# EasyEDA Pro project ProProject_MagicBerry_2.1.epro, schematic sch_2.1

## Sheets
1 mcu: Create Date: 2023-12-22; Page Name: mcu; Project Name: MagicBerry_2.1; Schematic Name: sch_2.1; Update Date: 2023-12-22; Company: 嘉立创EDA; Drawed: MakerM0; Page Size: A4; Version: V1.0
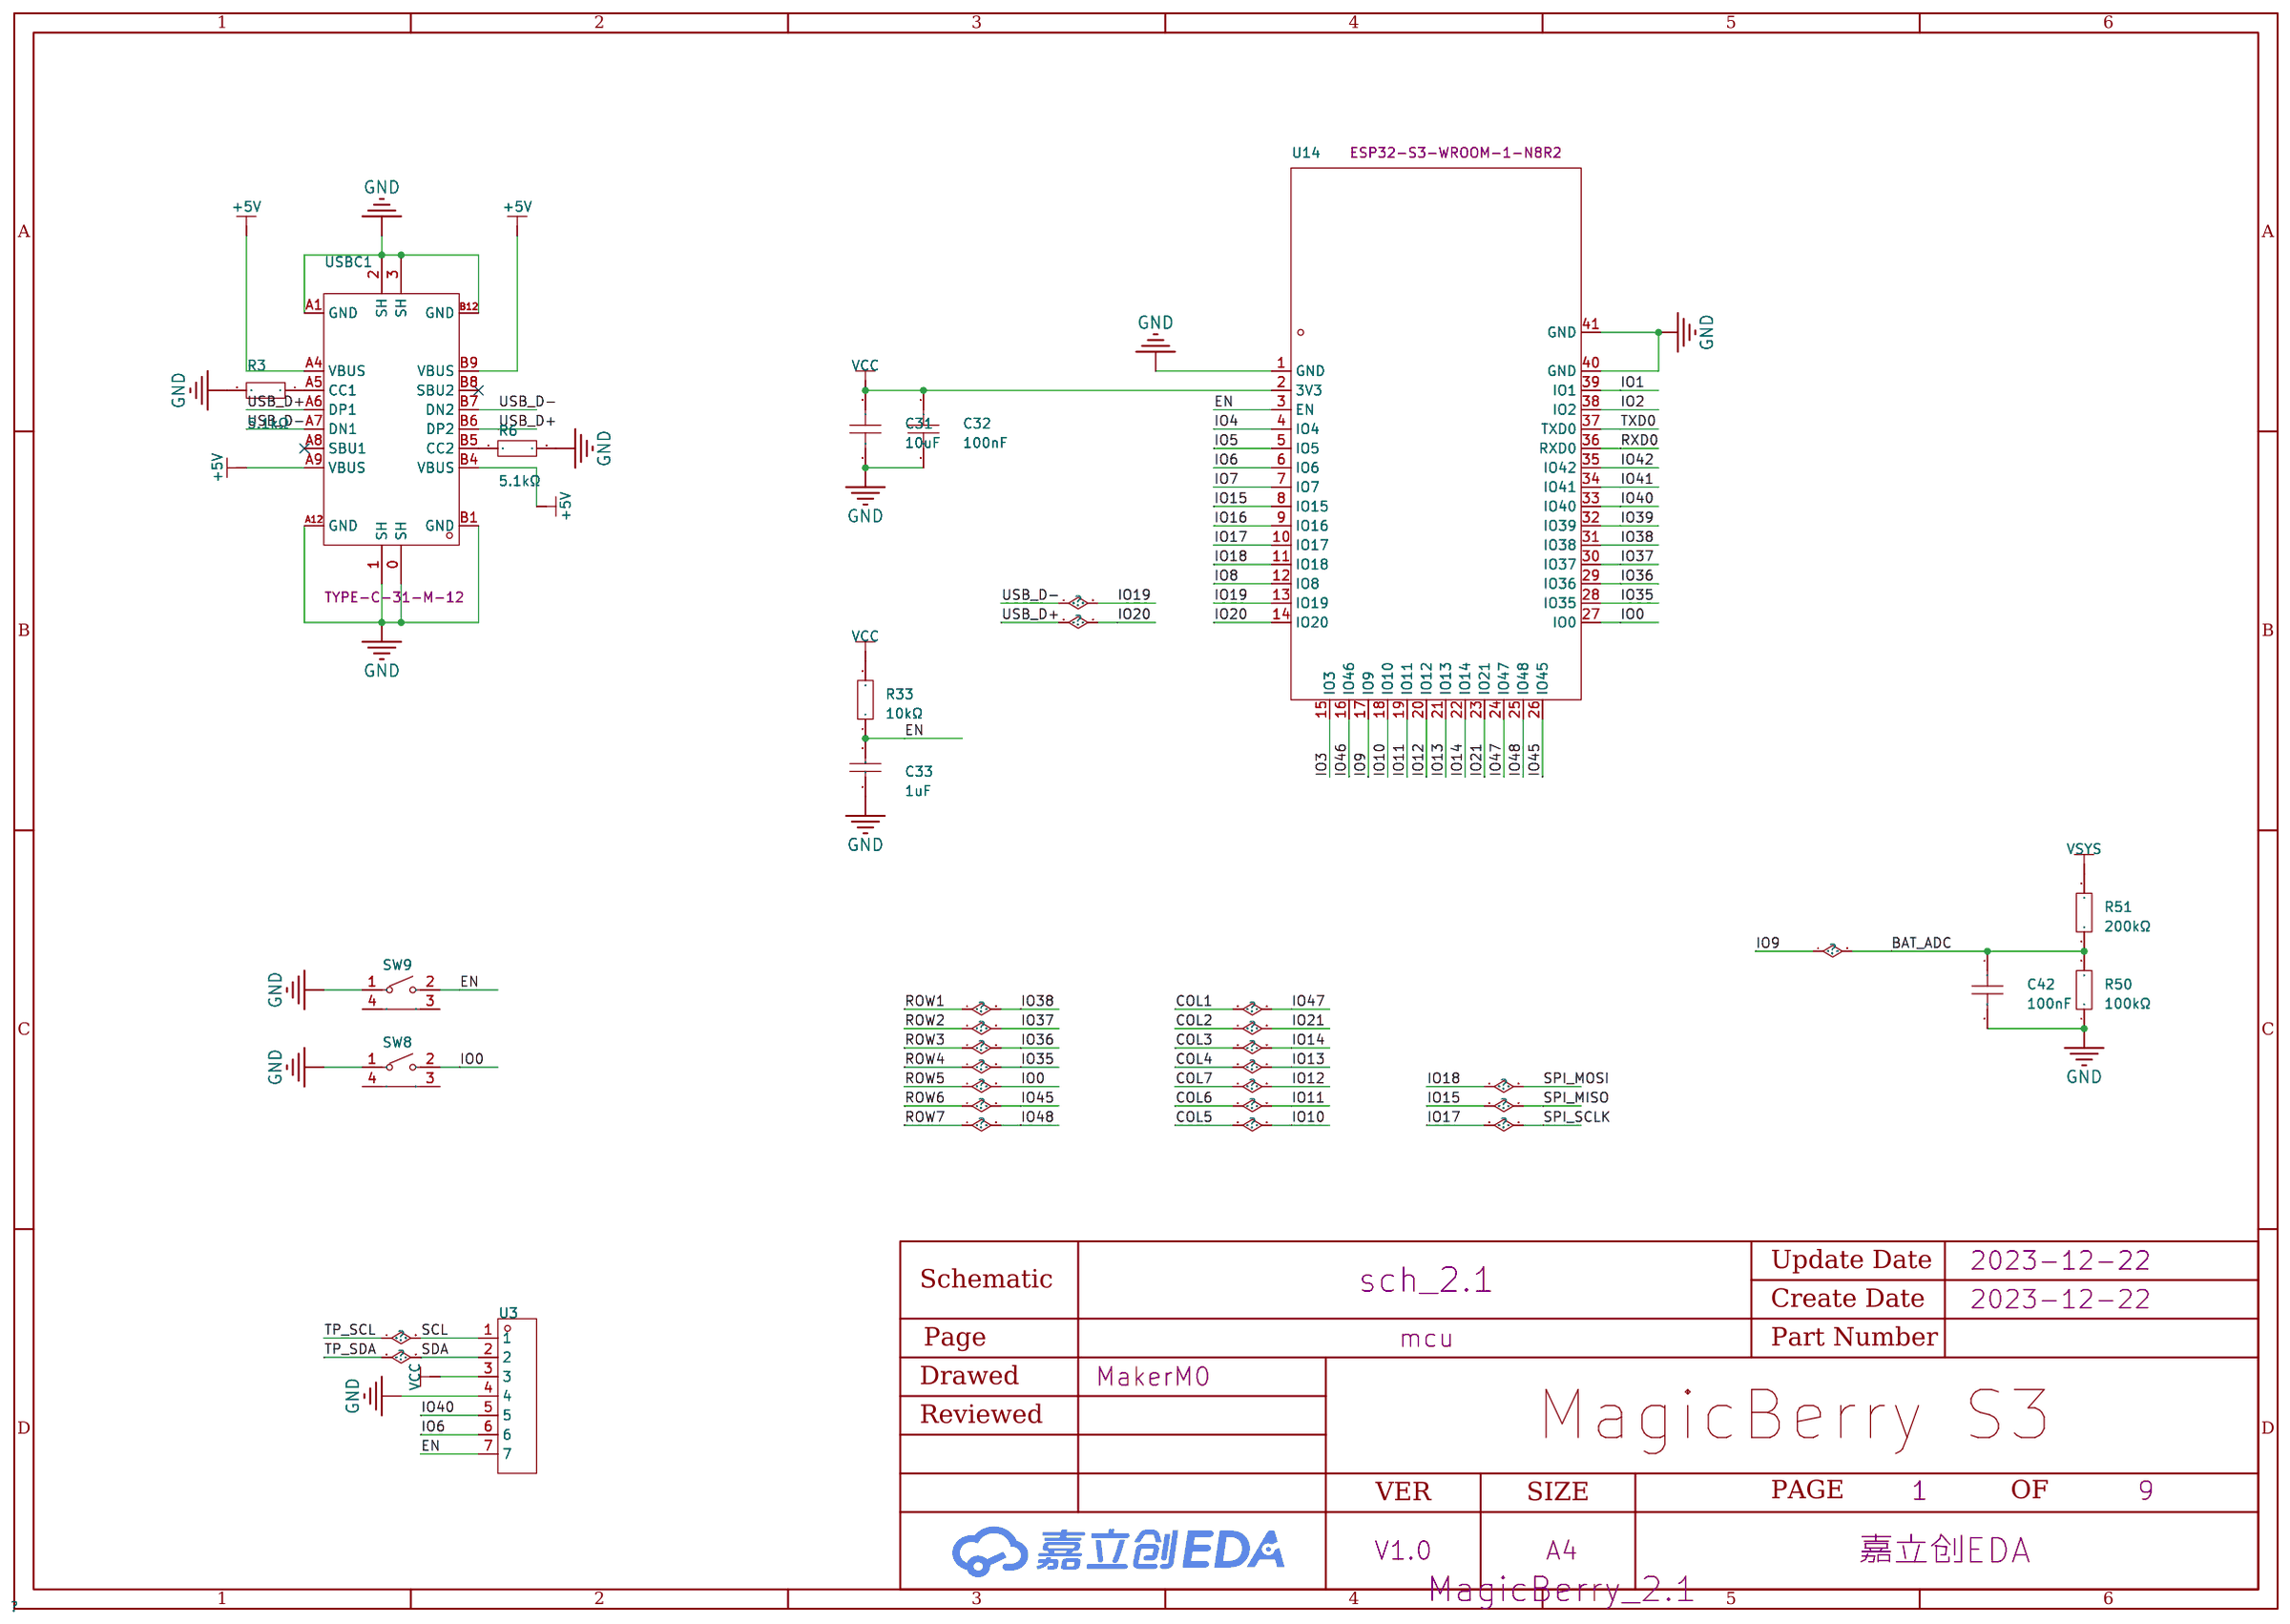
[diagram p0: mcu]
2 lcd: Create Date: 2023-09-30; Page Name: lcd; Project Name: #第八届立创电赛#MagicBerry  一个支持扩展的可编程全键盘终端; Update Date: 2023-09-30
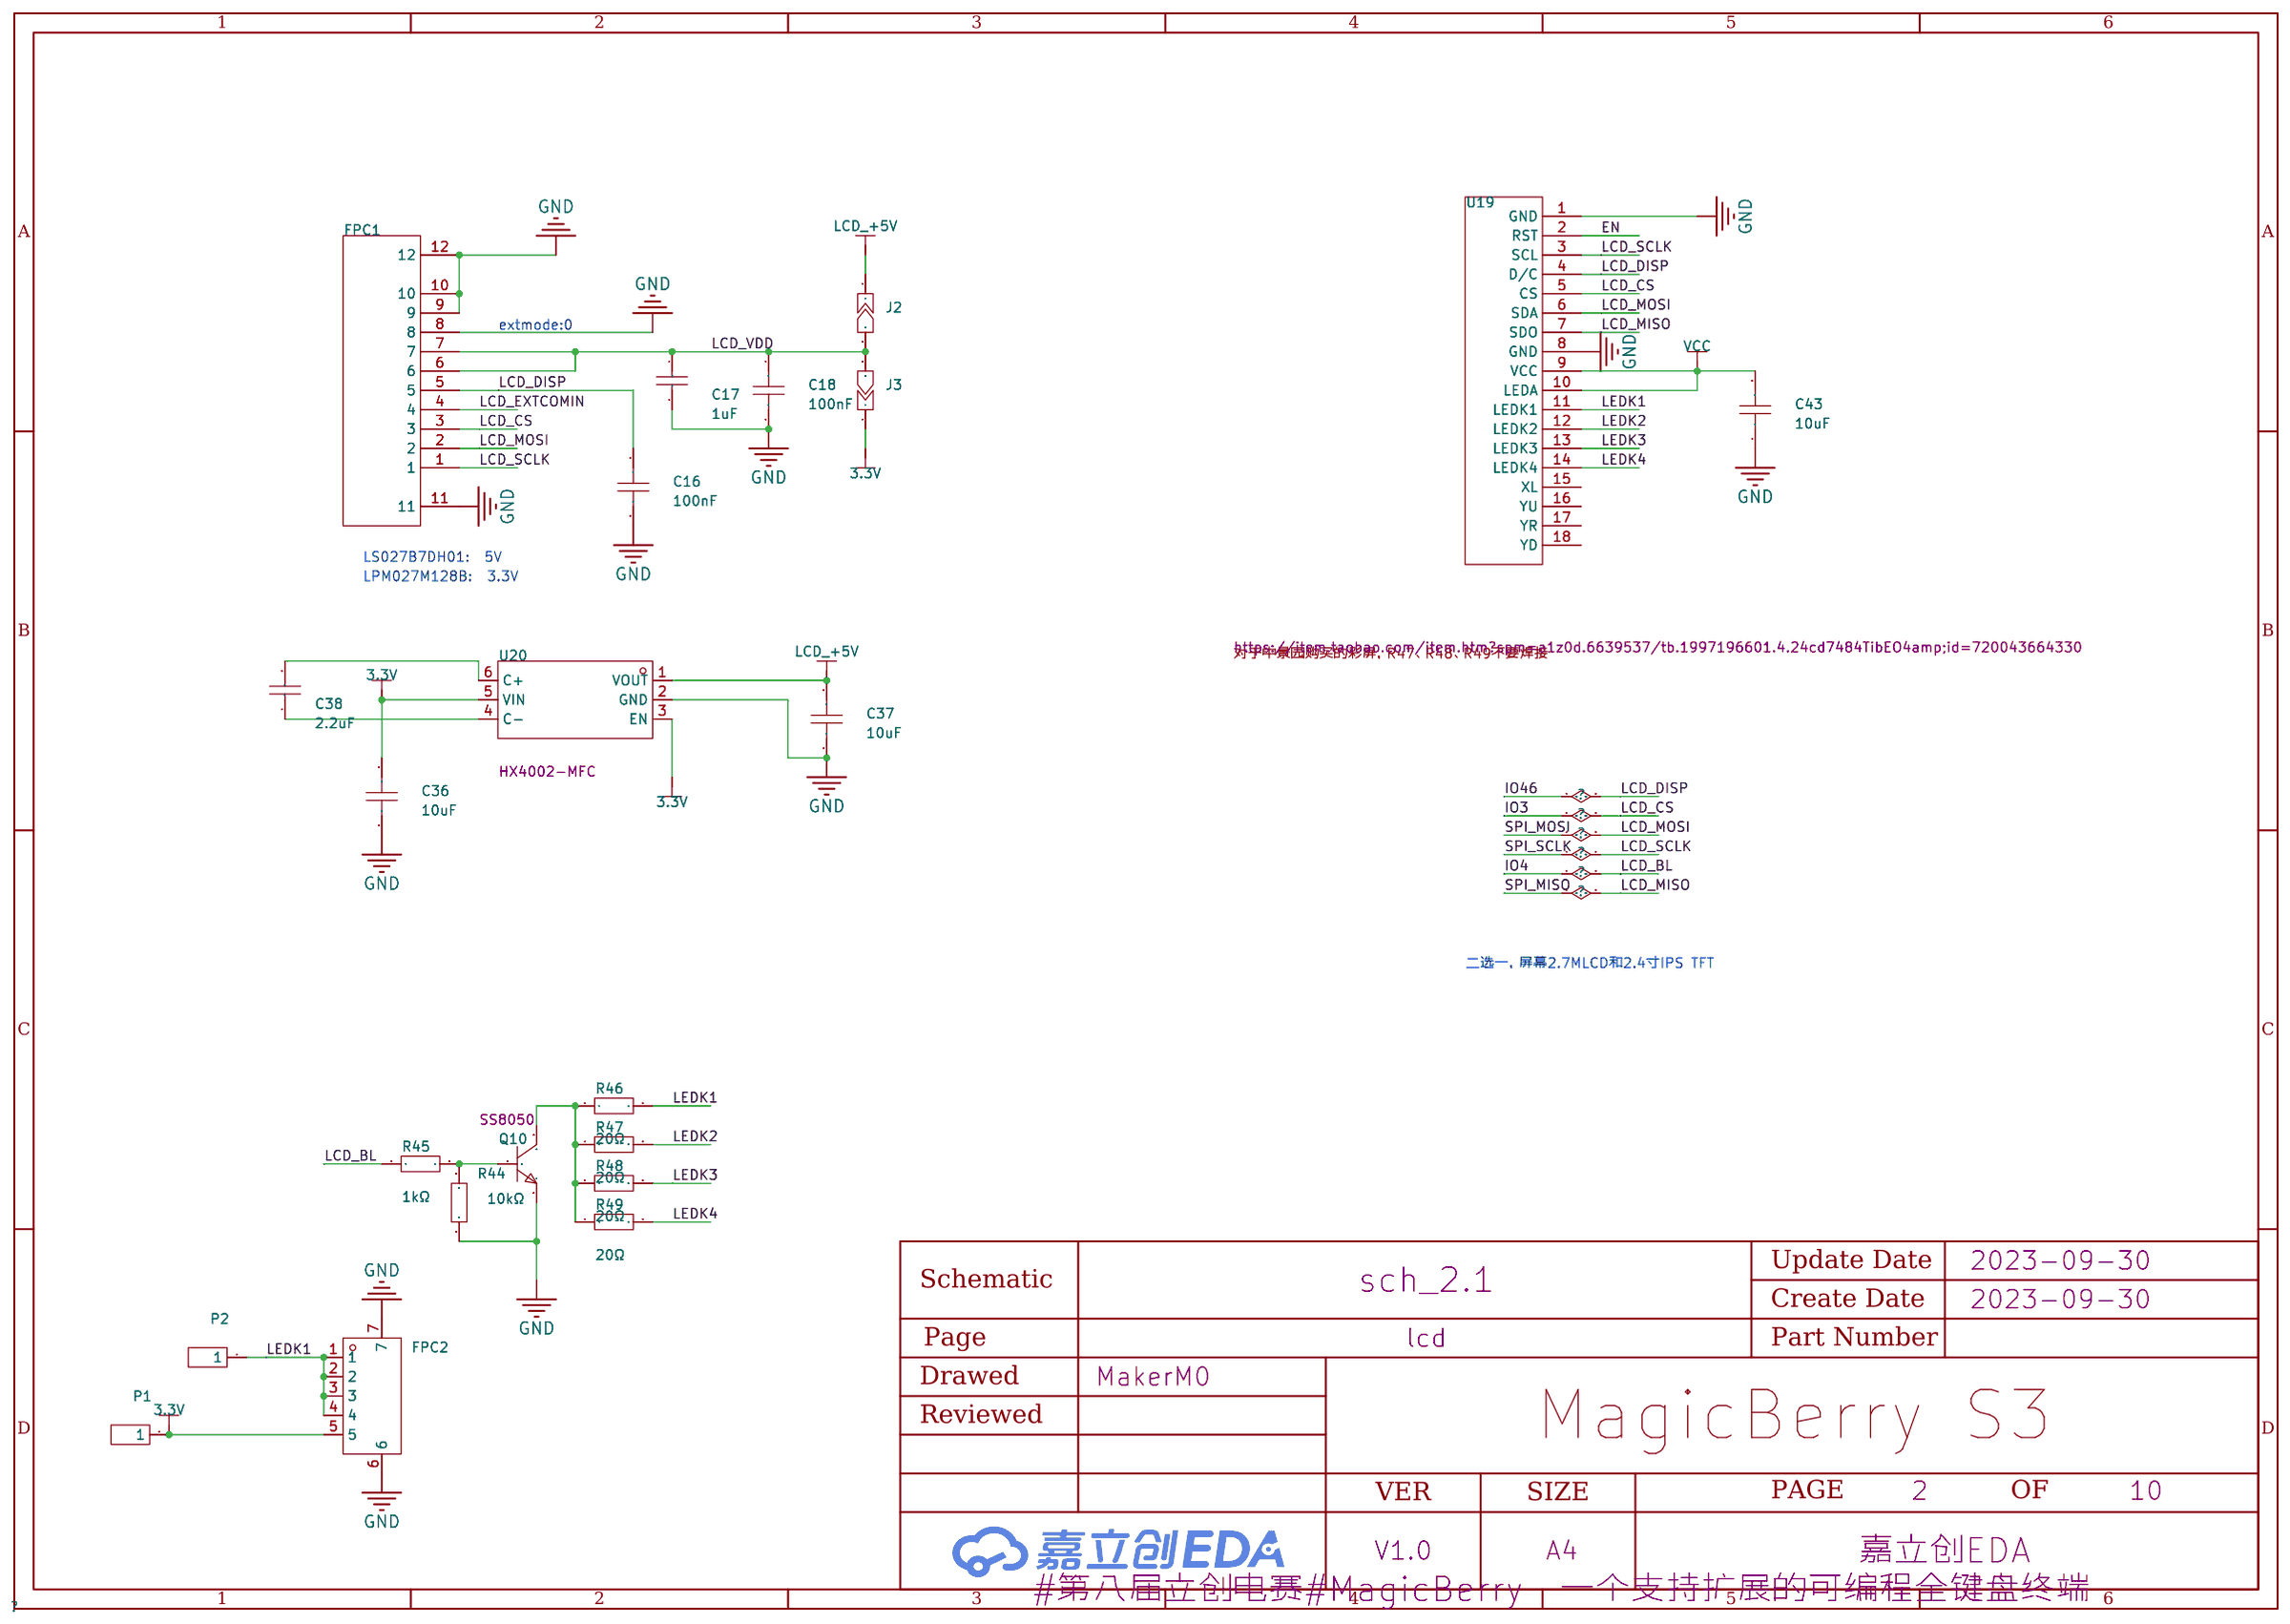
[diagram p1: lcd]
3 sd: Create Date: 2023-05-03; Page Name: sd; Project Name: MagiComputer; Schematic Name: Schematic1_2; Update Date: 2023-06-03
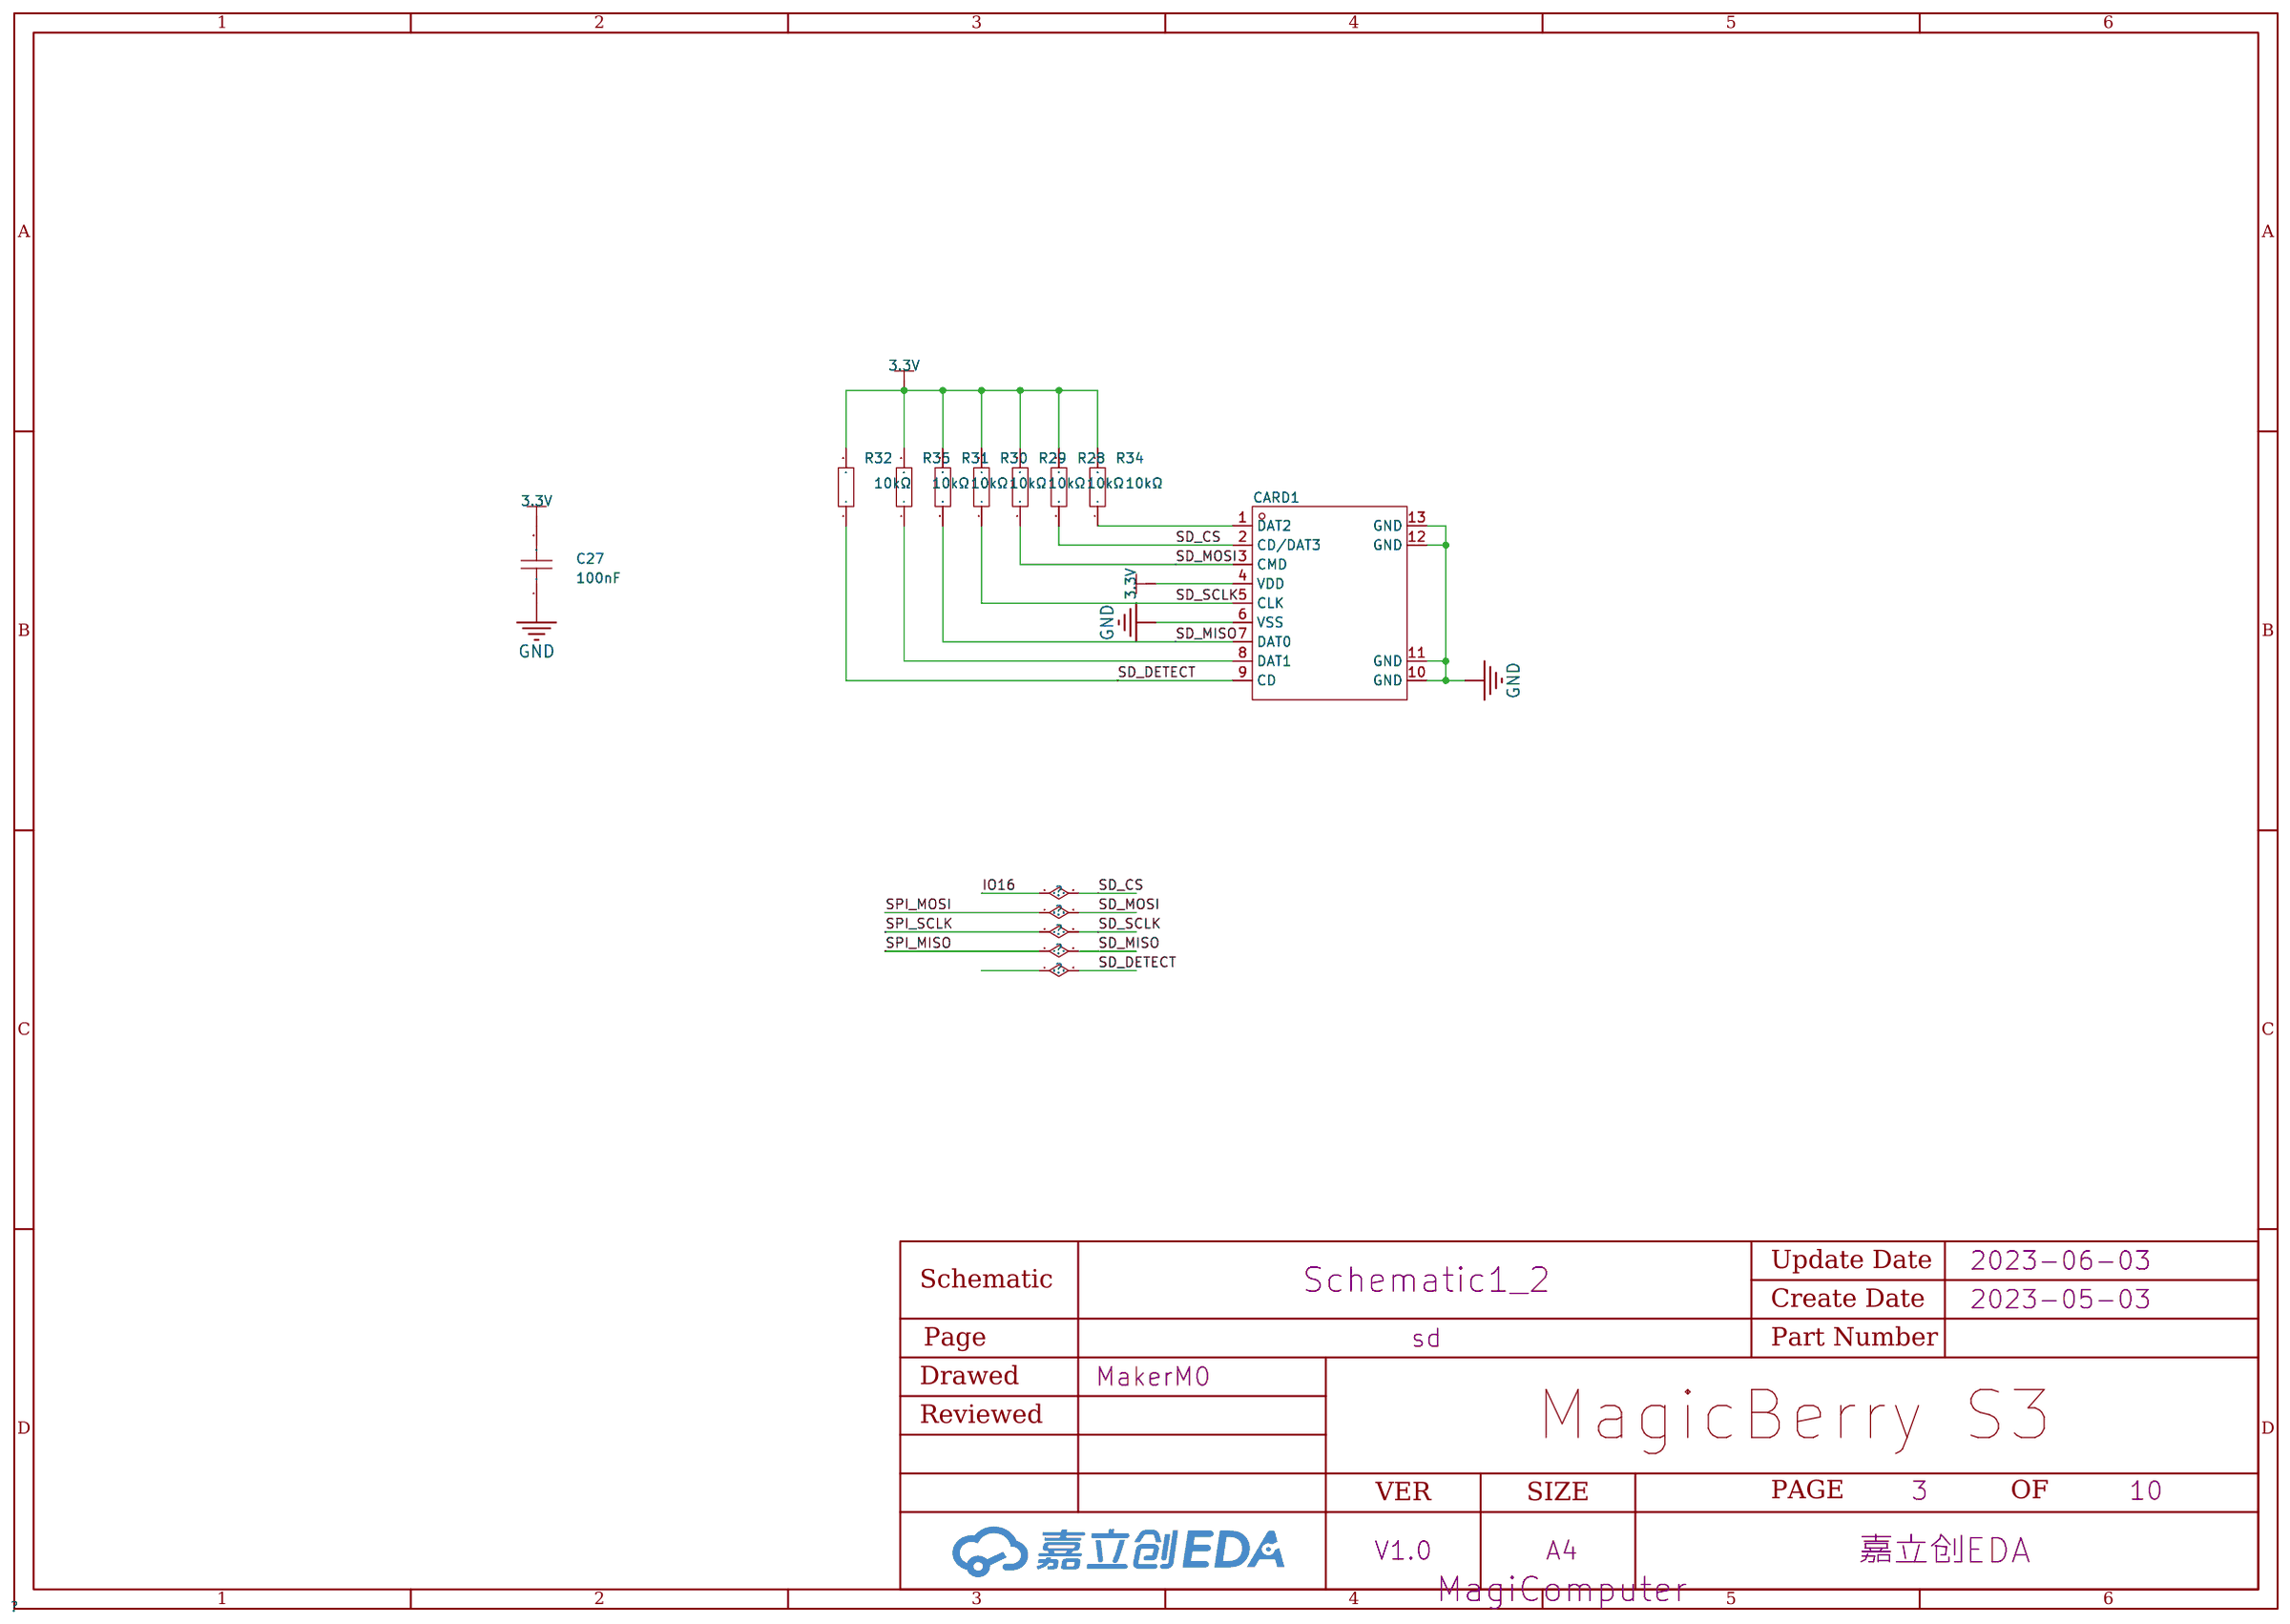
[diagram p2: sd]
4 power: Page Name: power
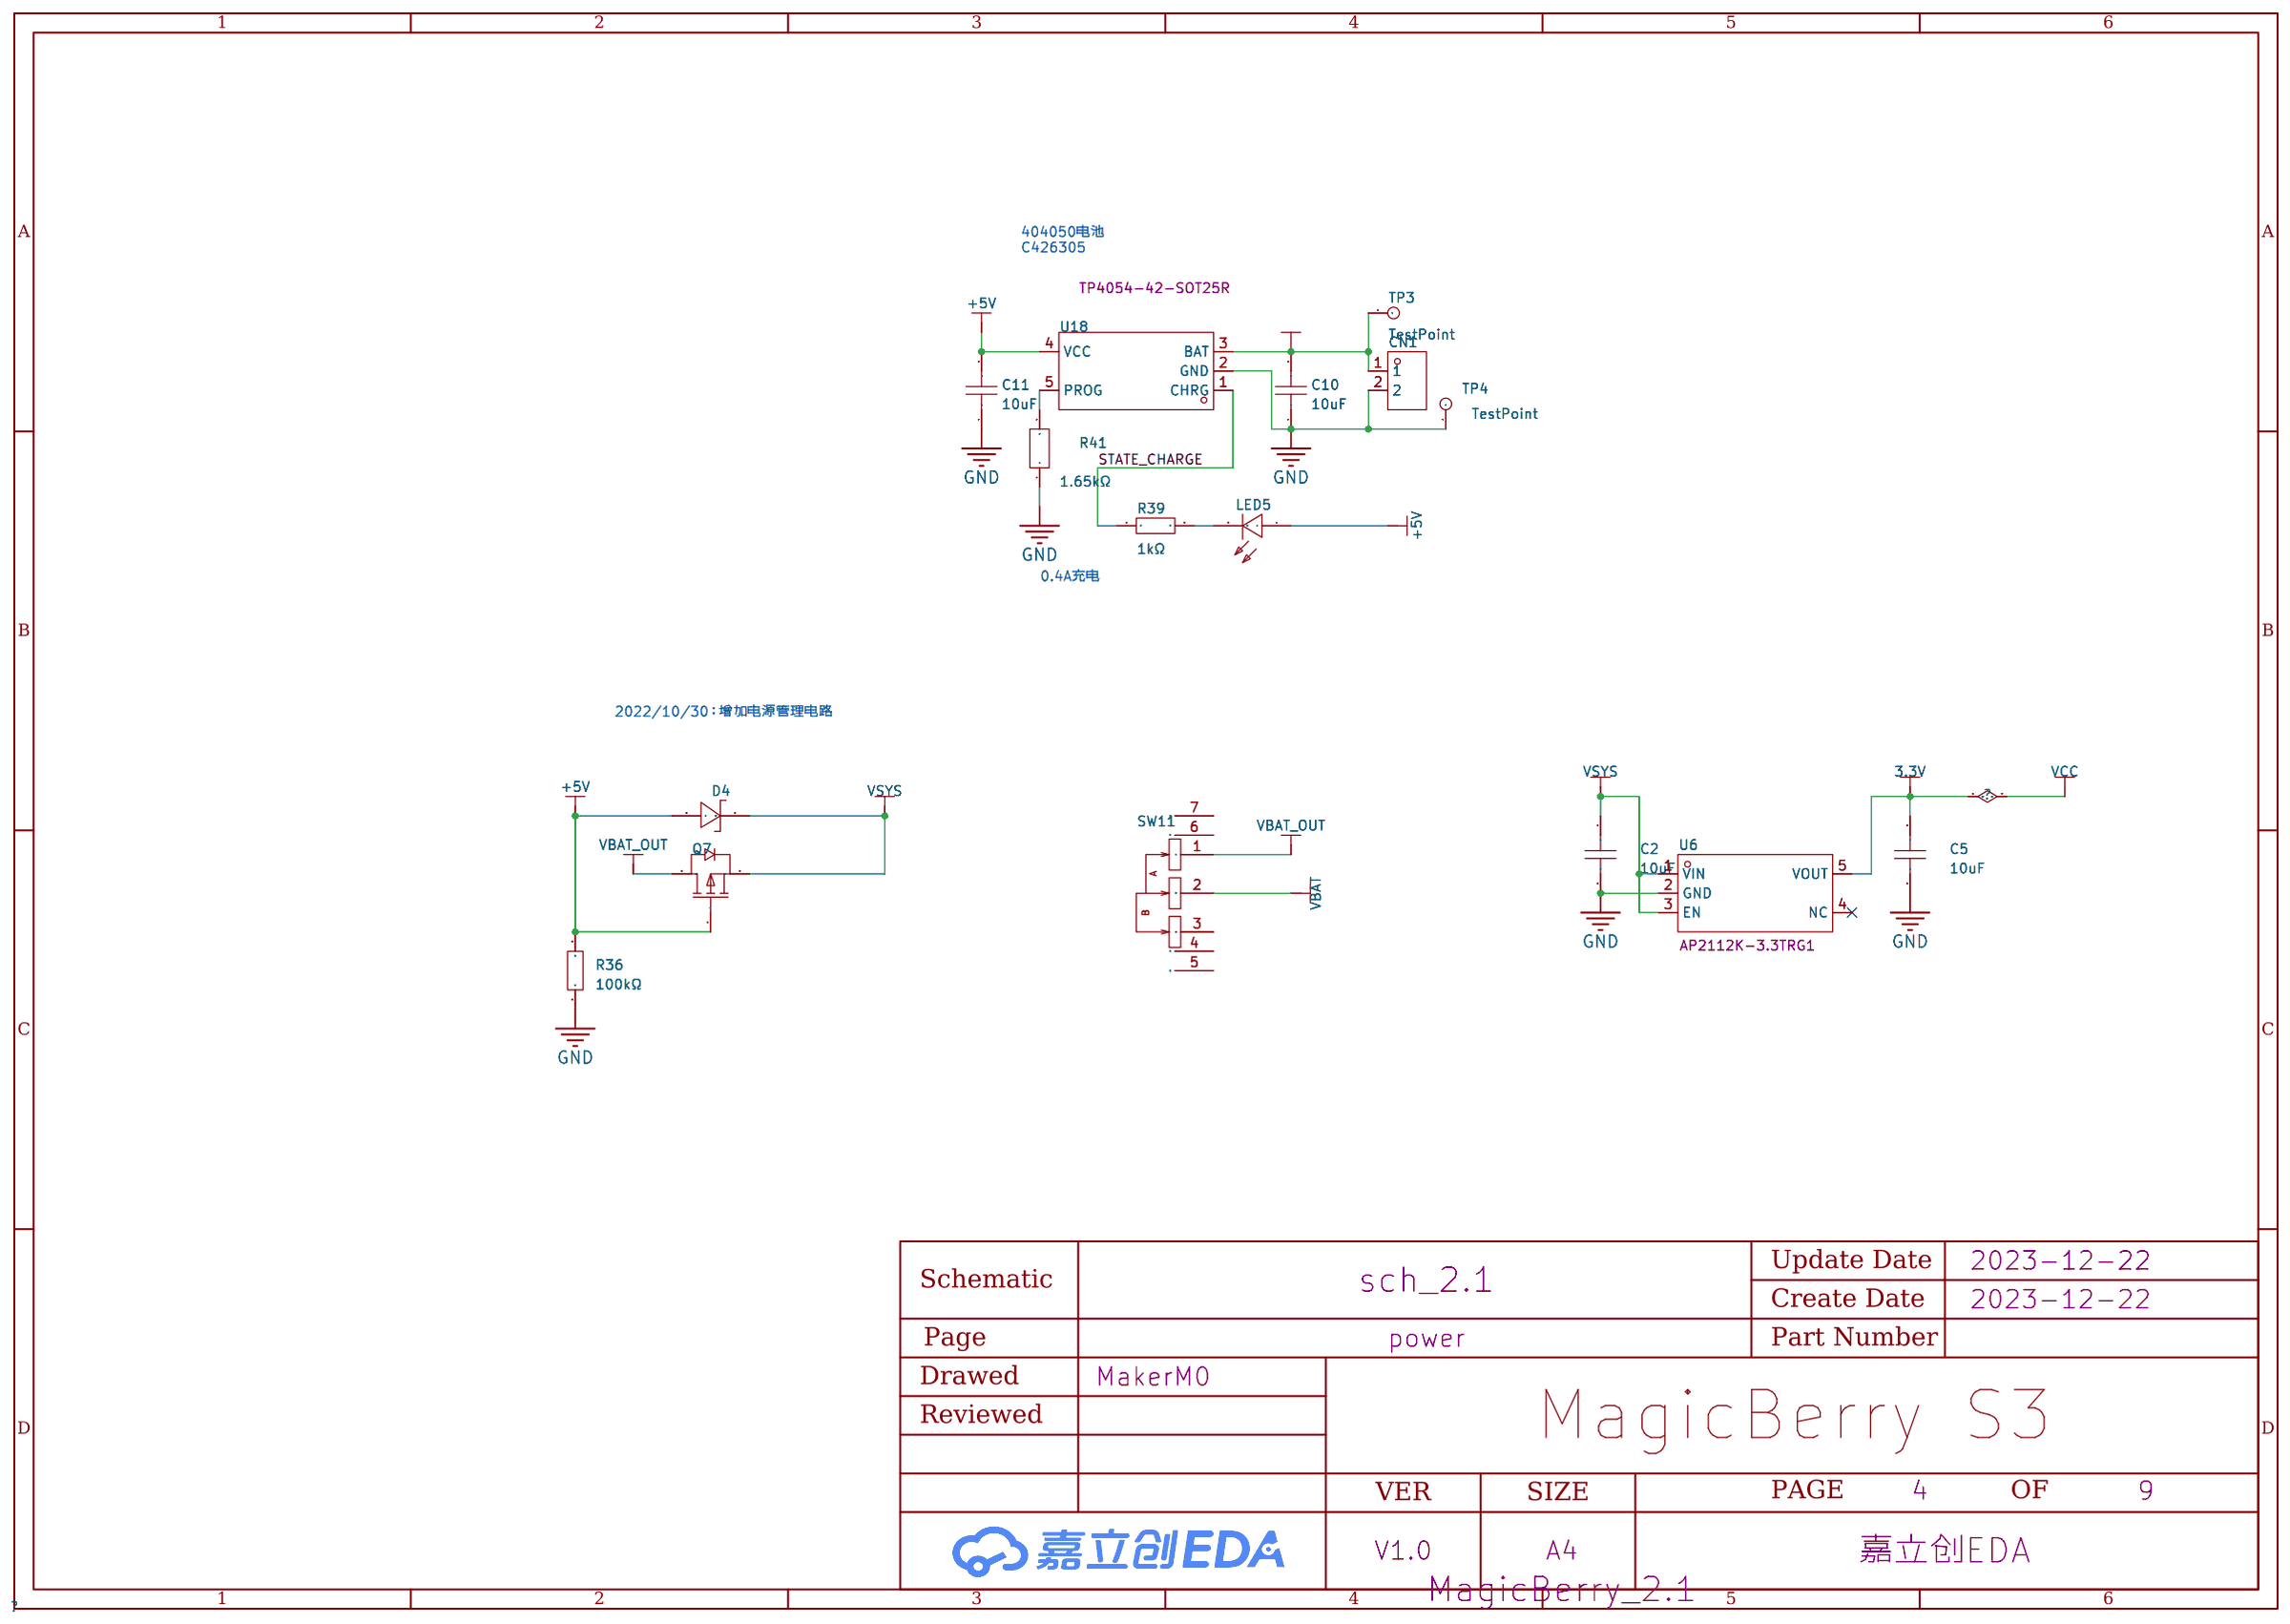
[diagram p3: power]
5 speaker: Page Name: speaker
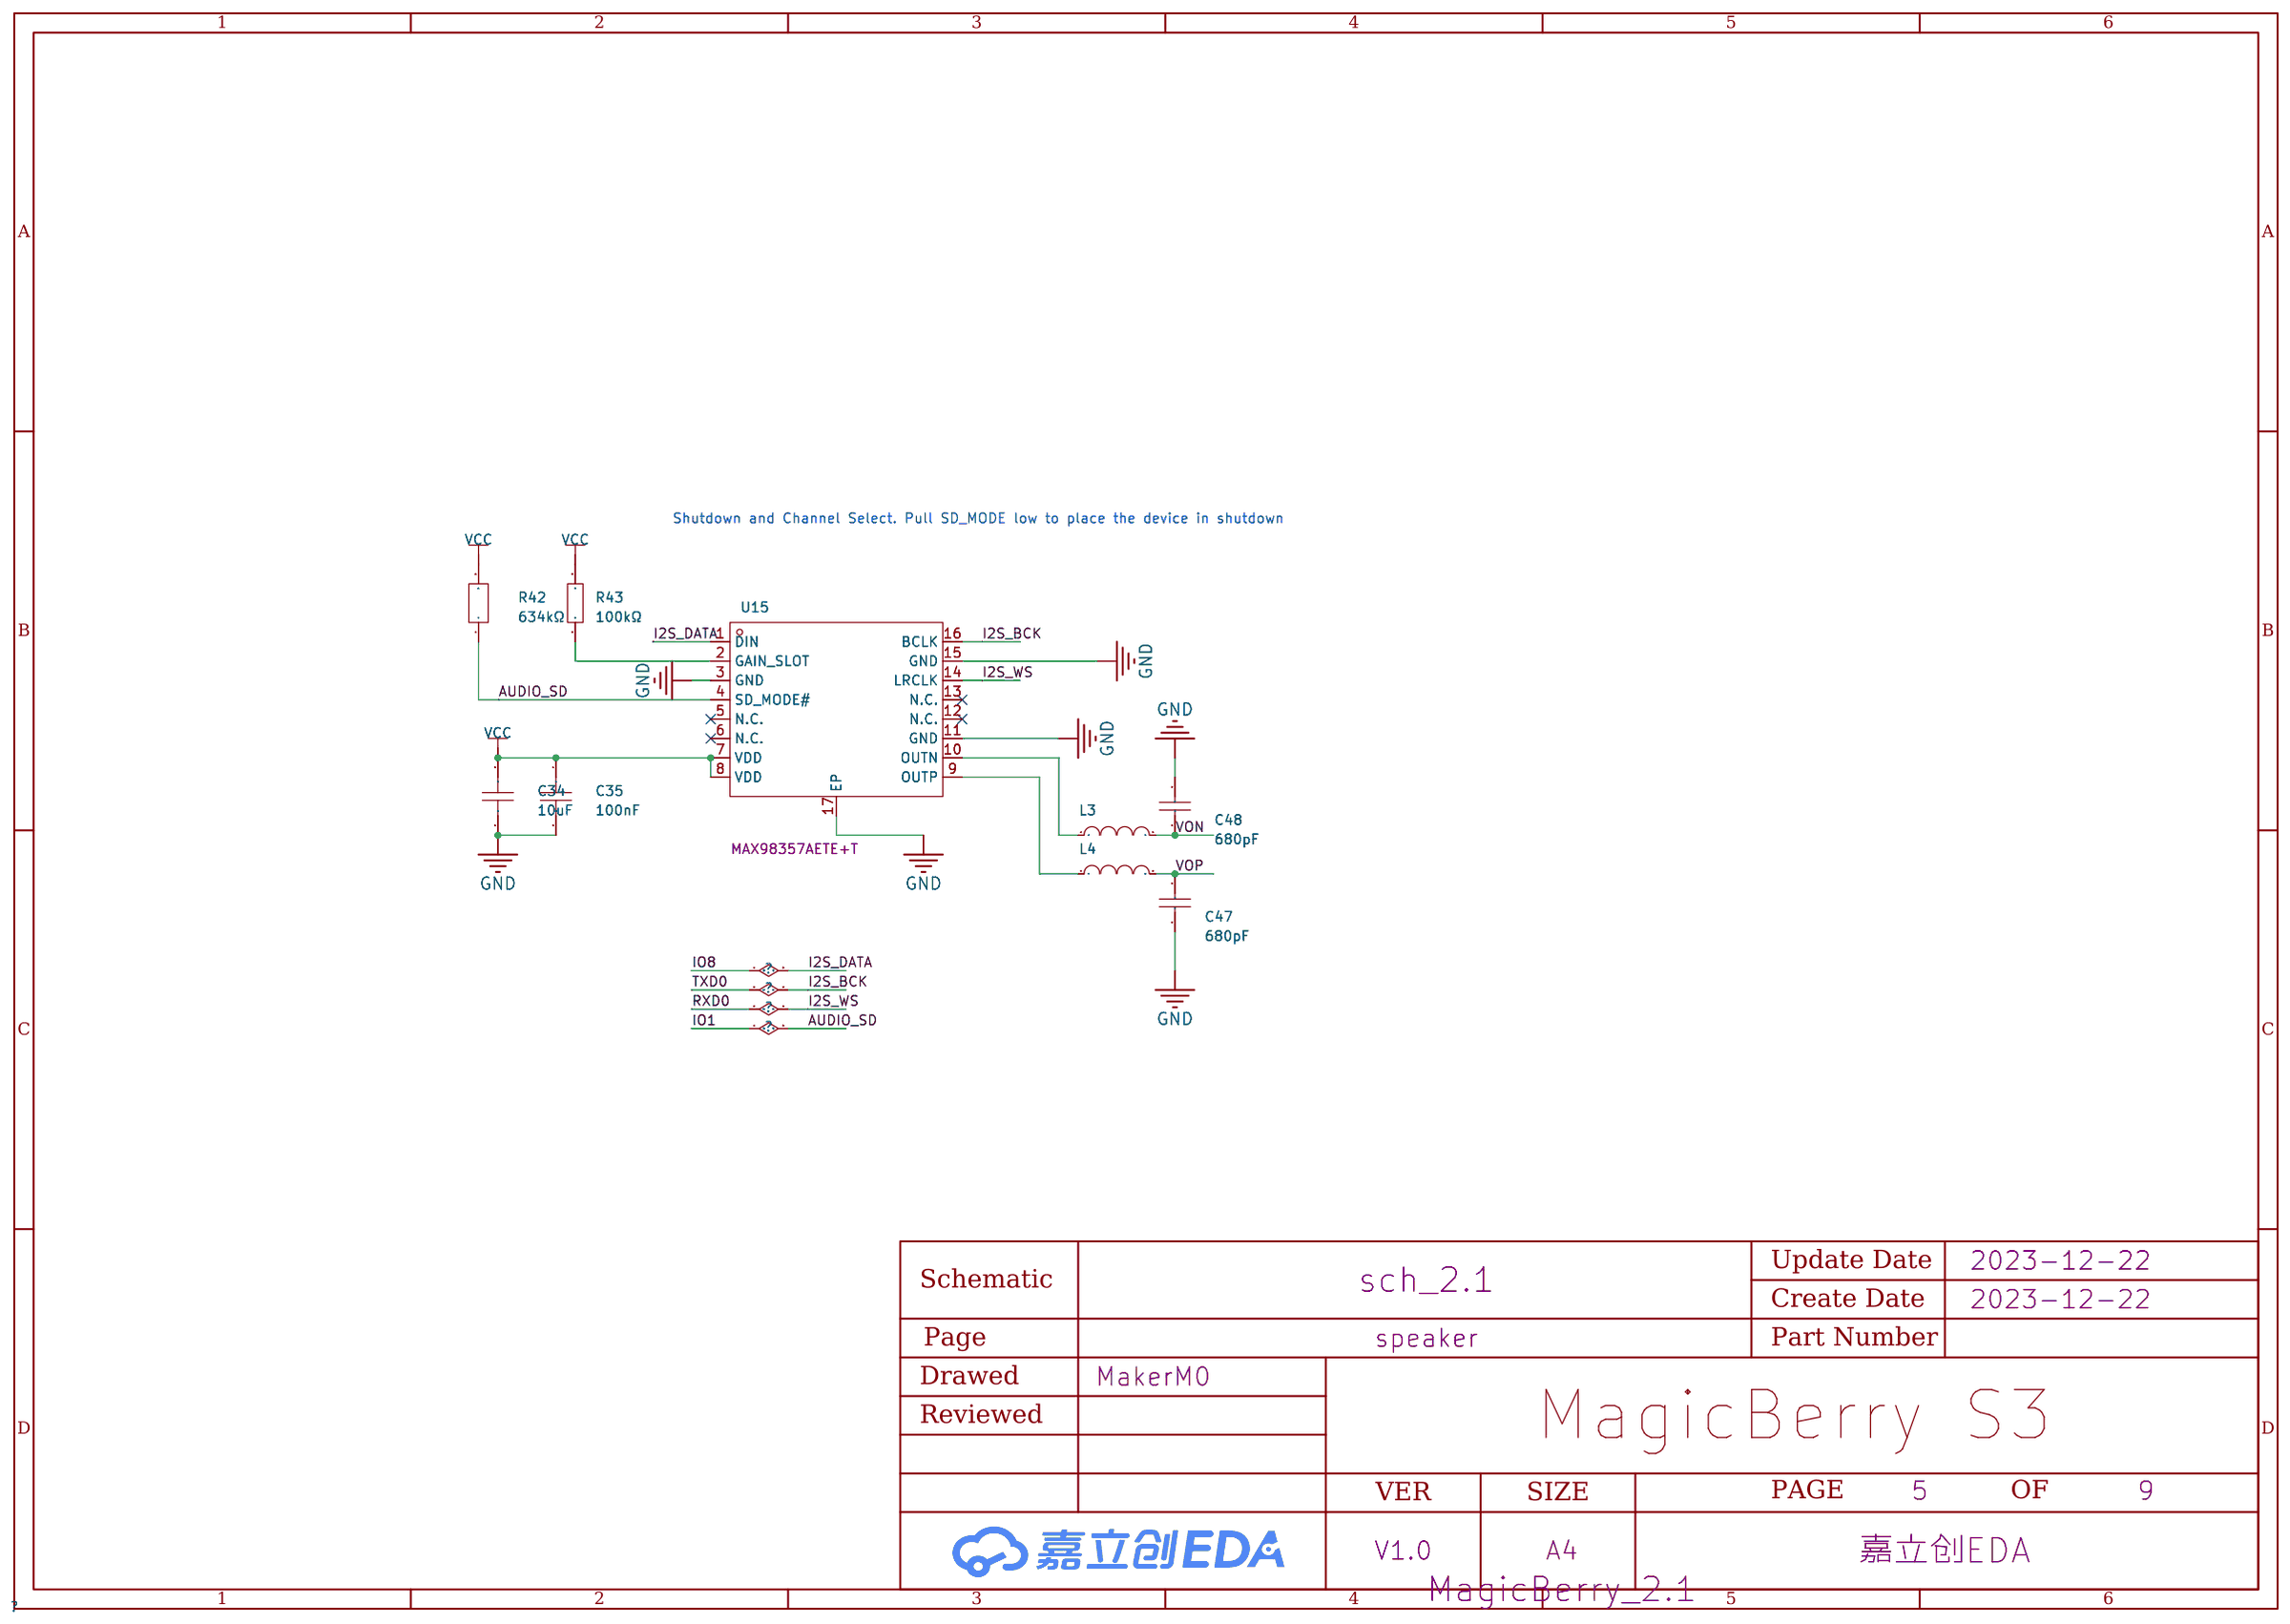
[diagram p4: speaker]
6 lora: Page Name: lora
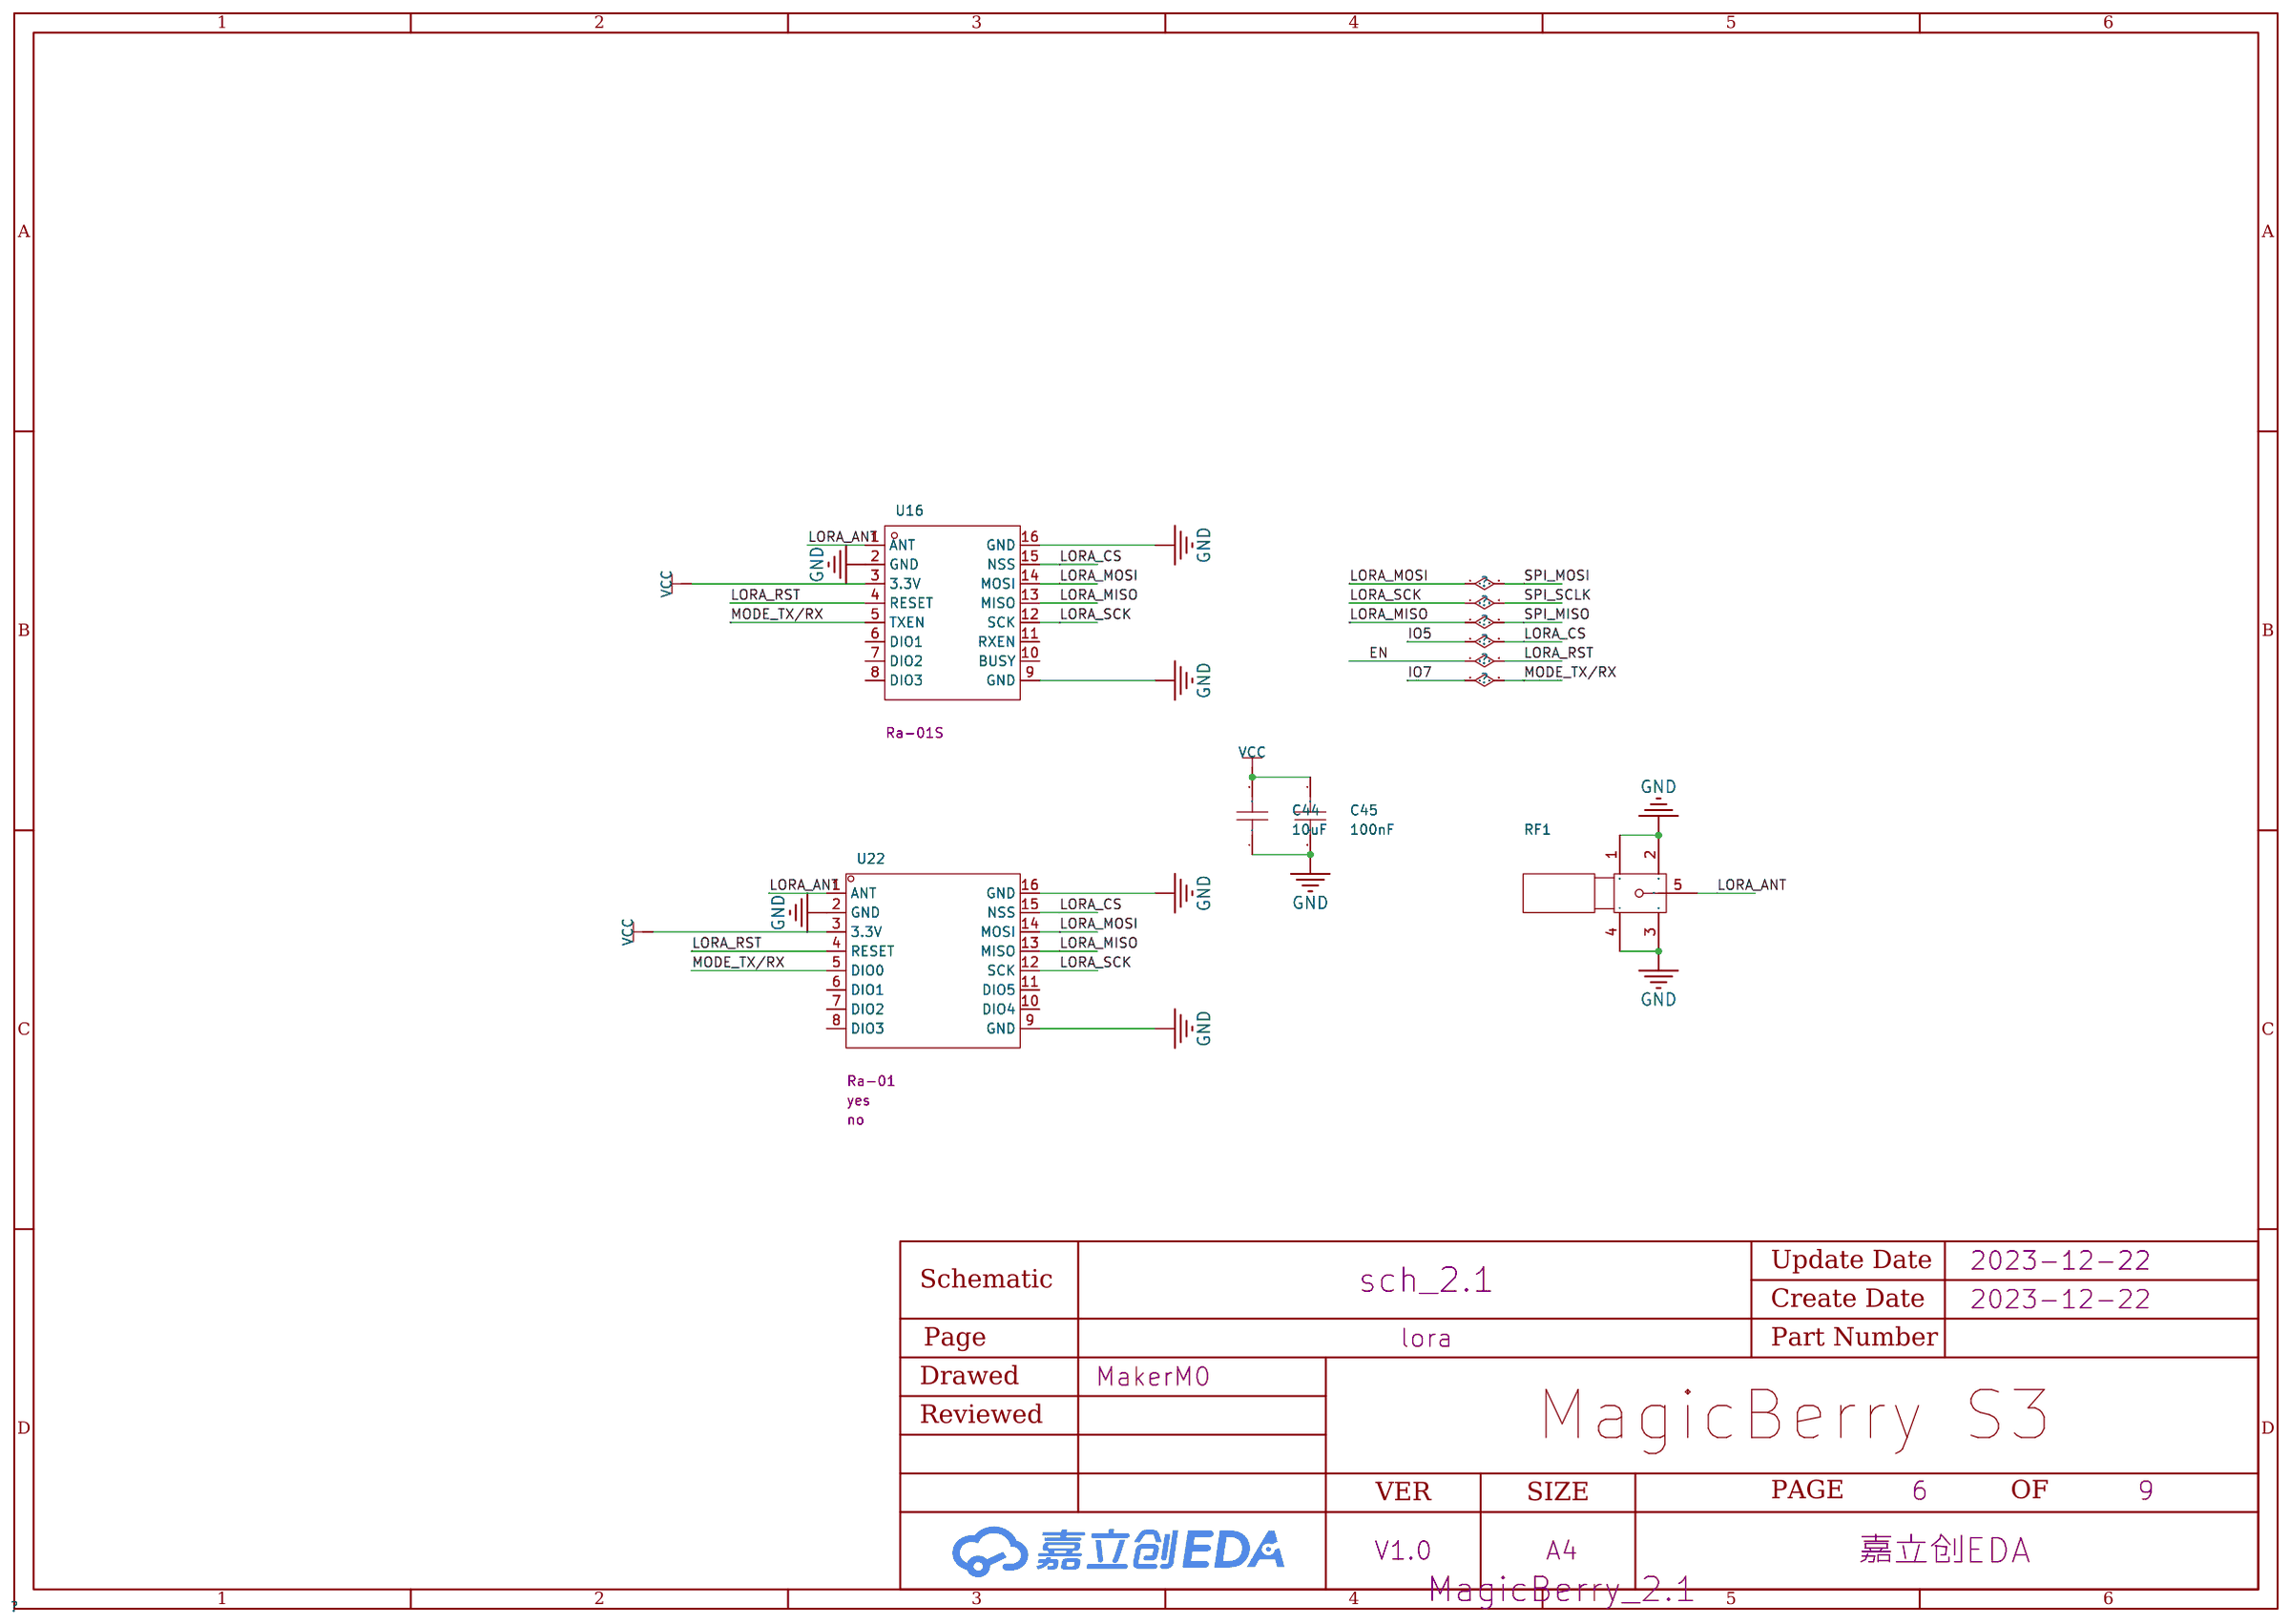
[diagram p5: lora]
7 keyboard: Page Name: keyboard
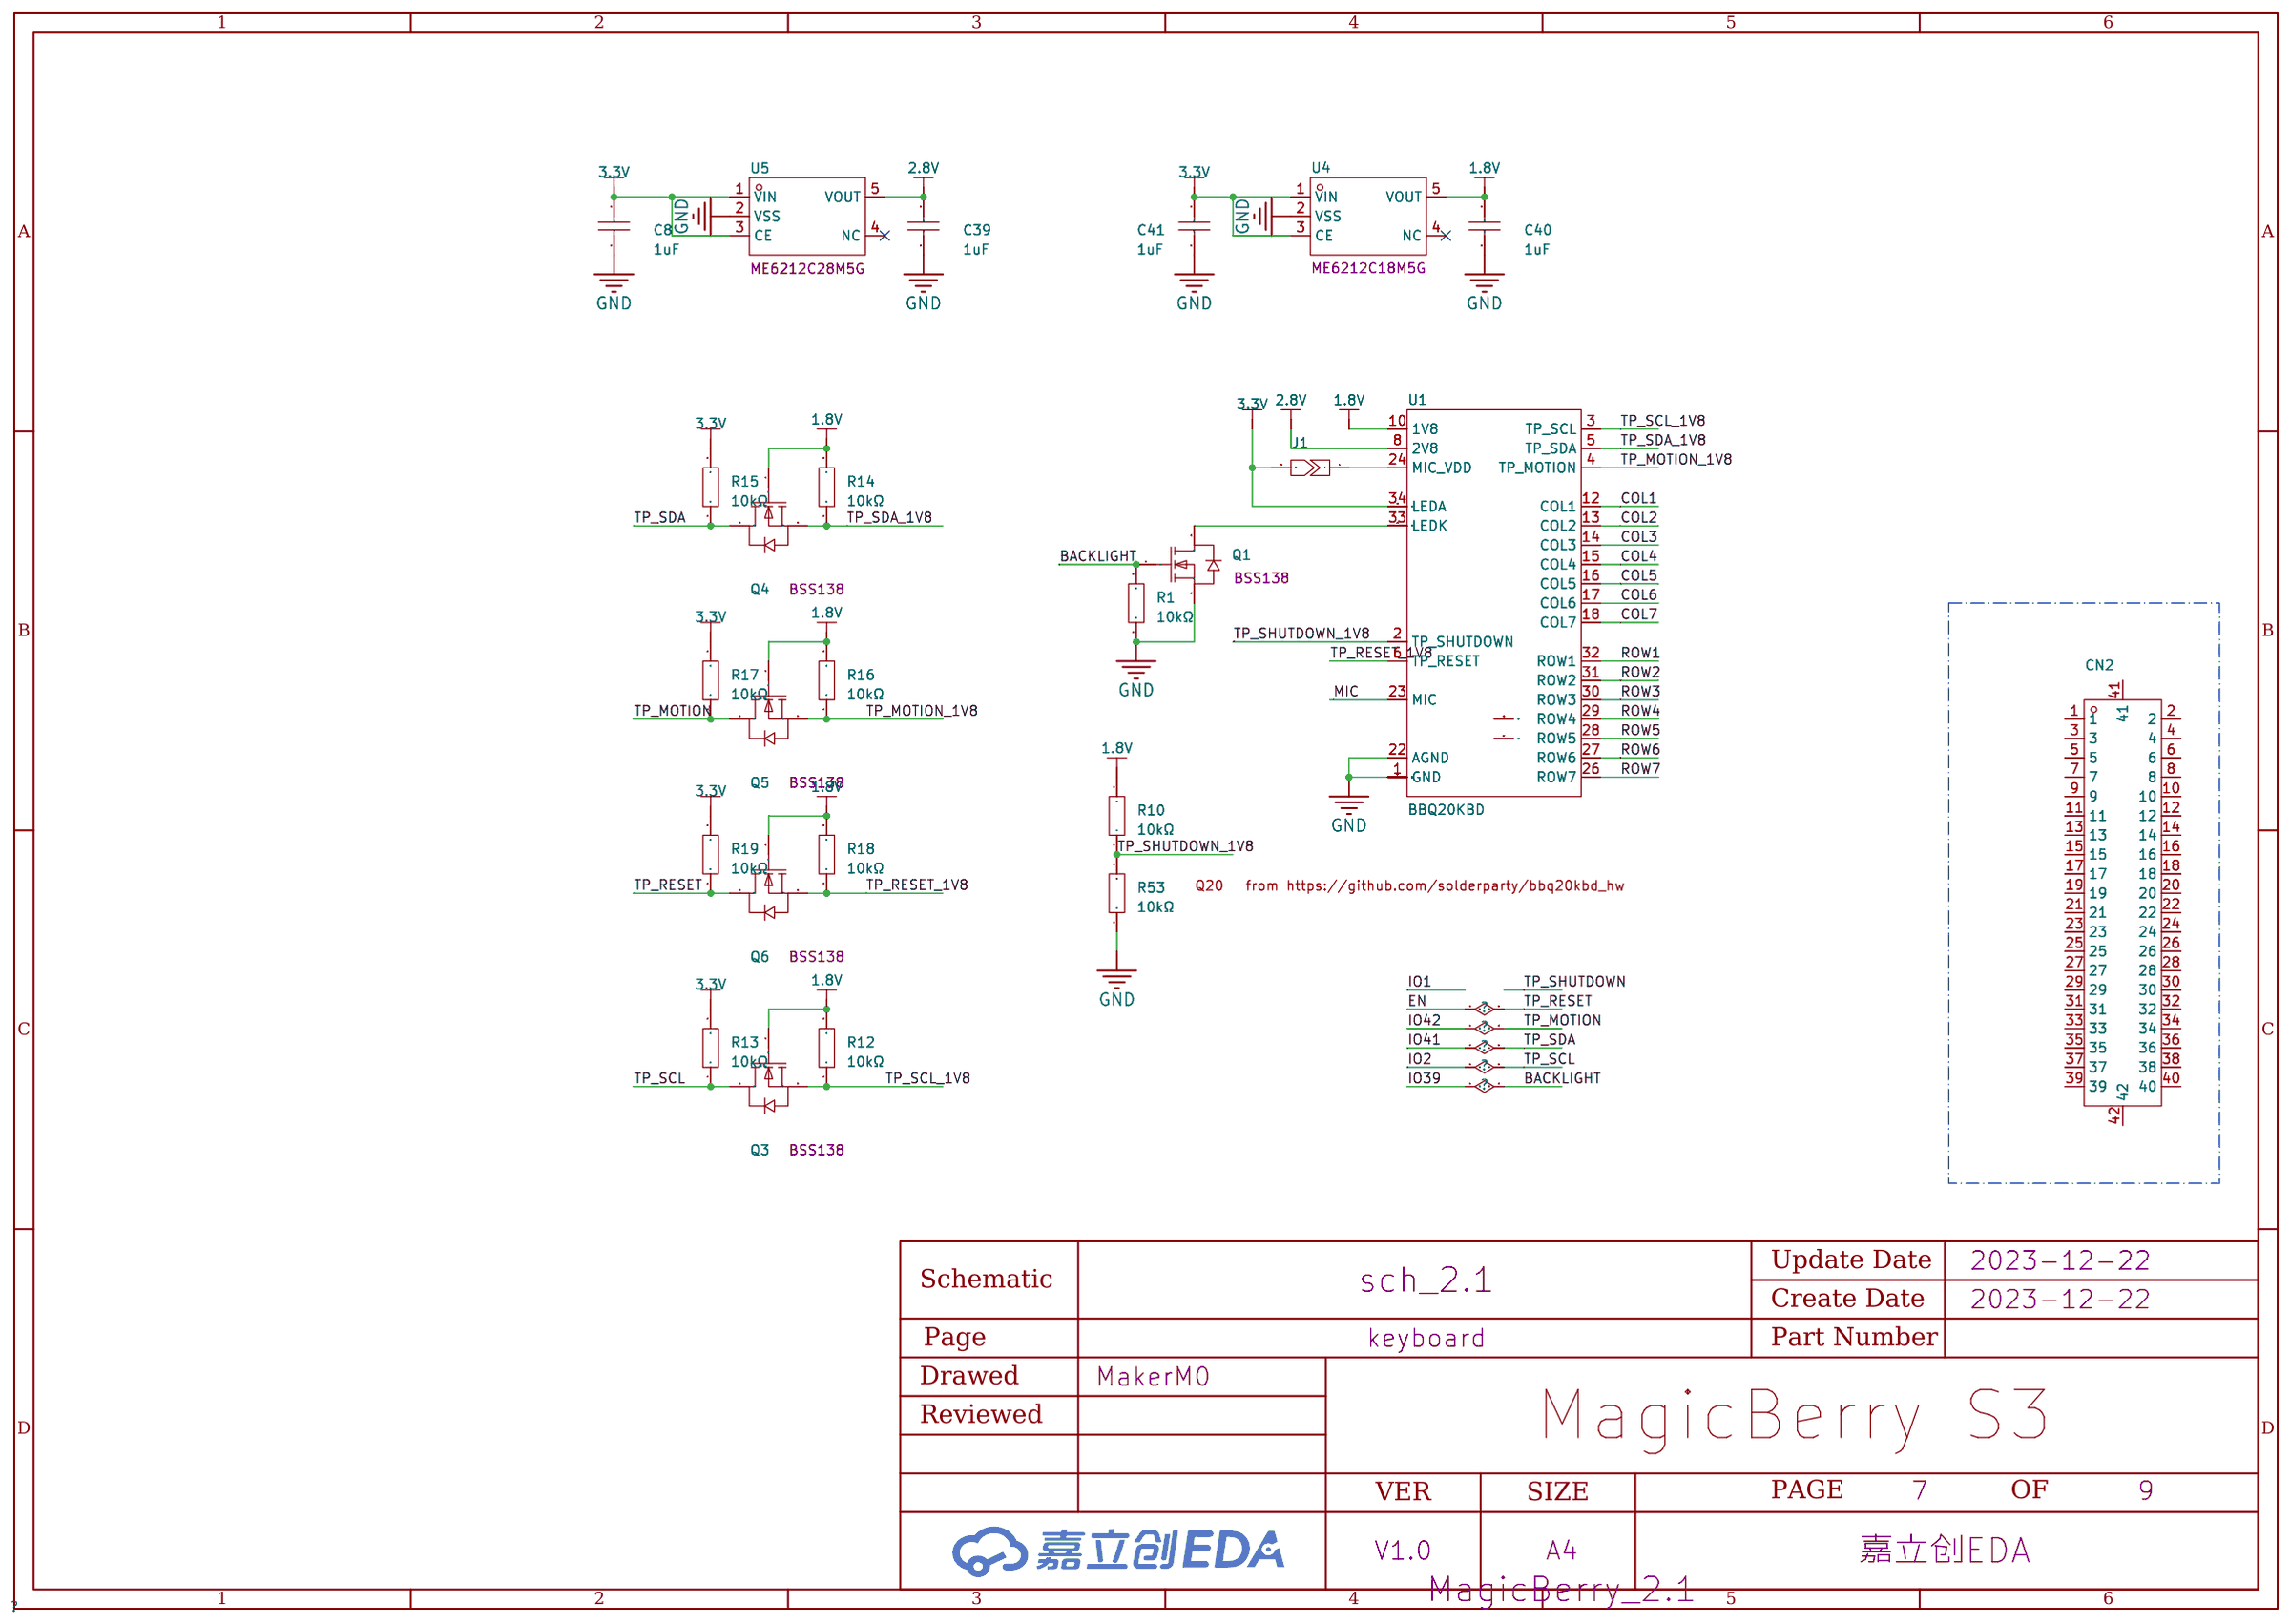
[diagram p6: keyboard]
8 rtc: Page Name: rtc
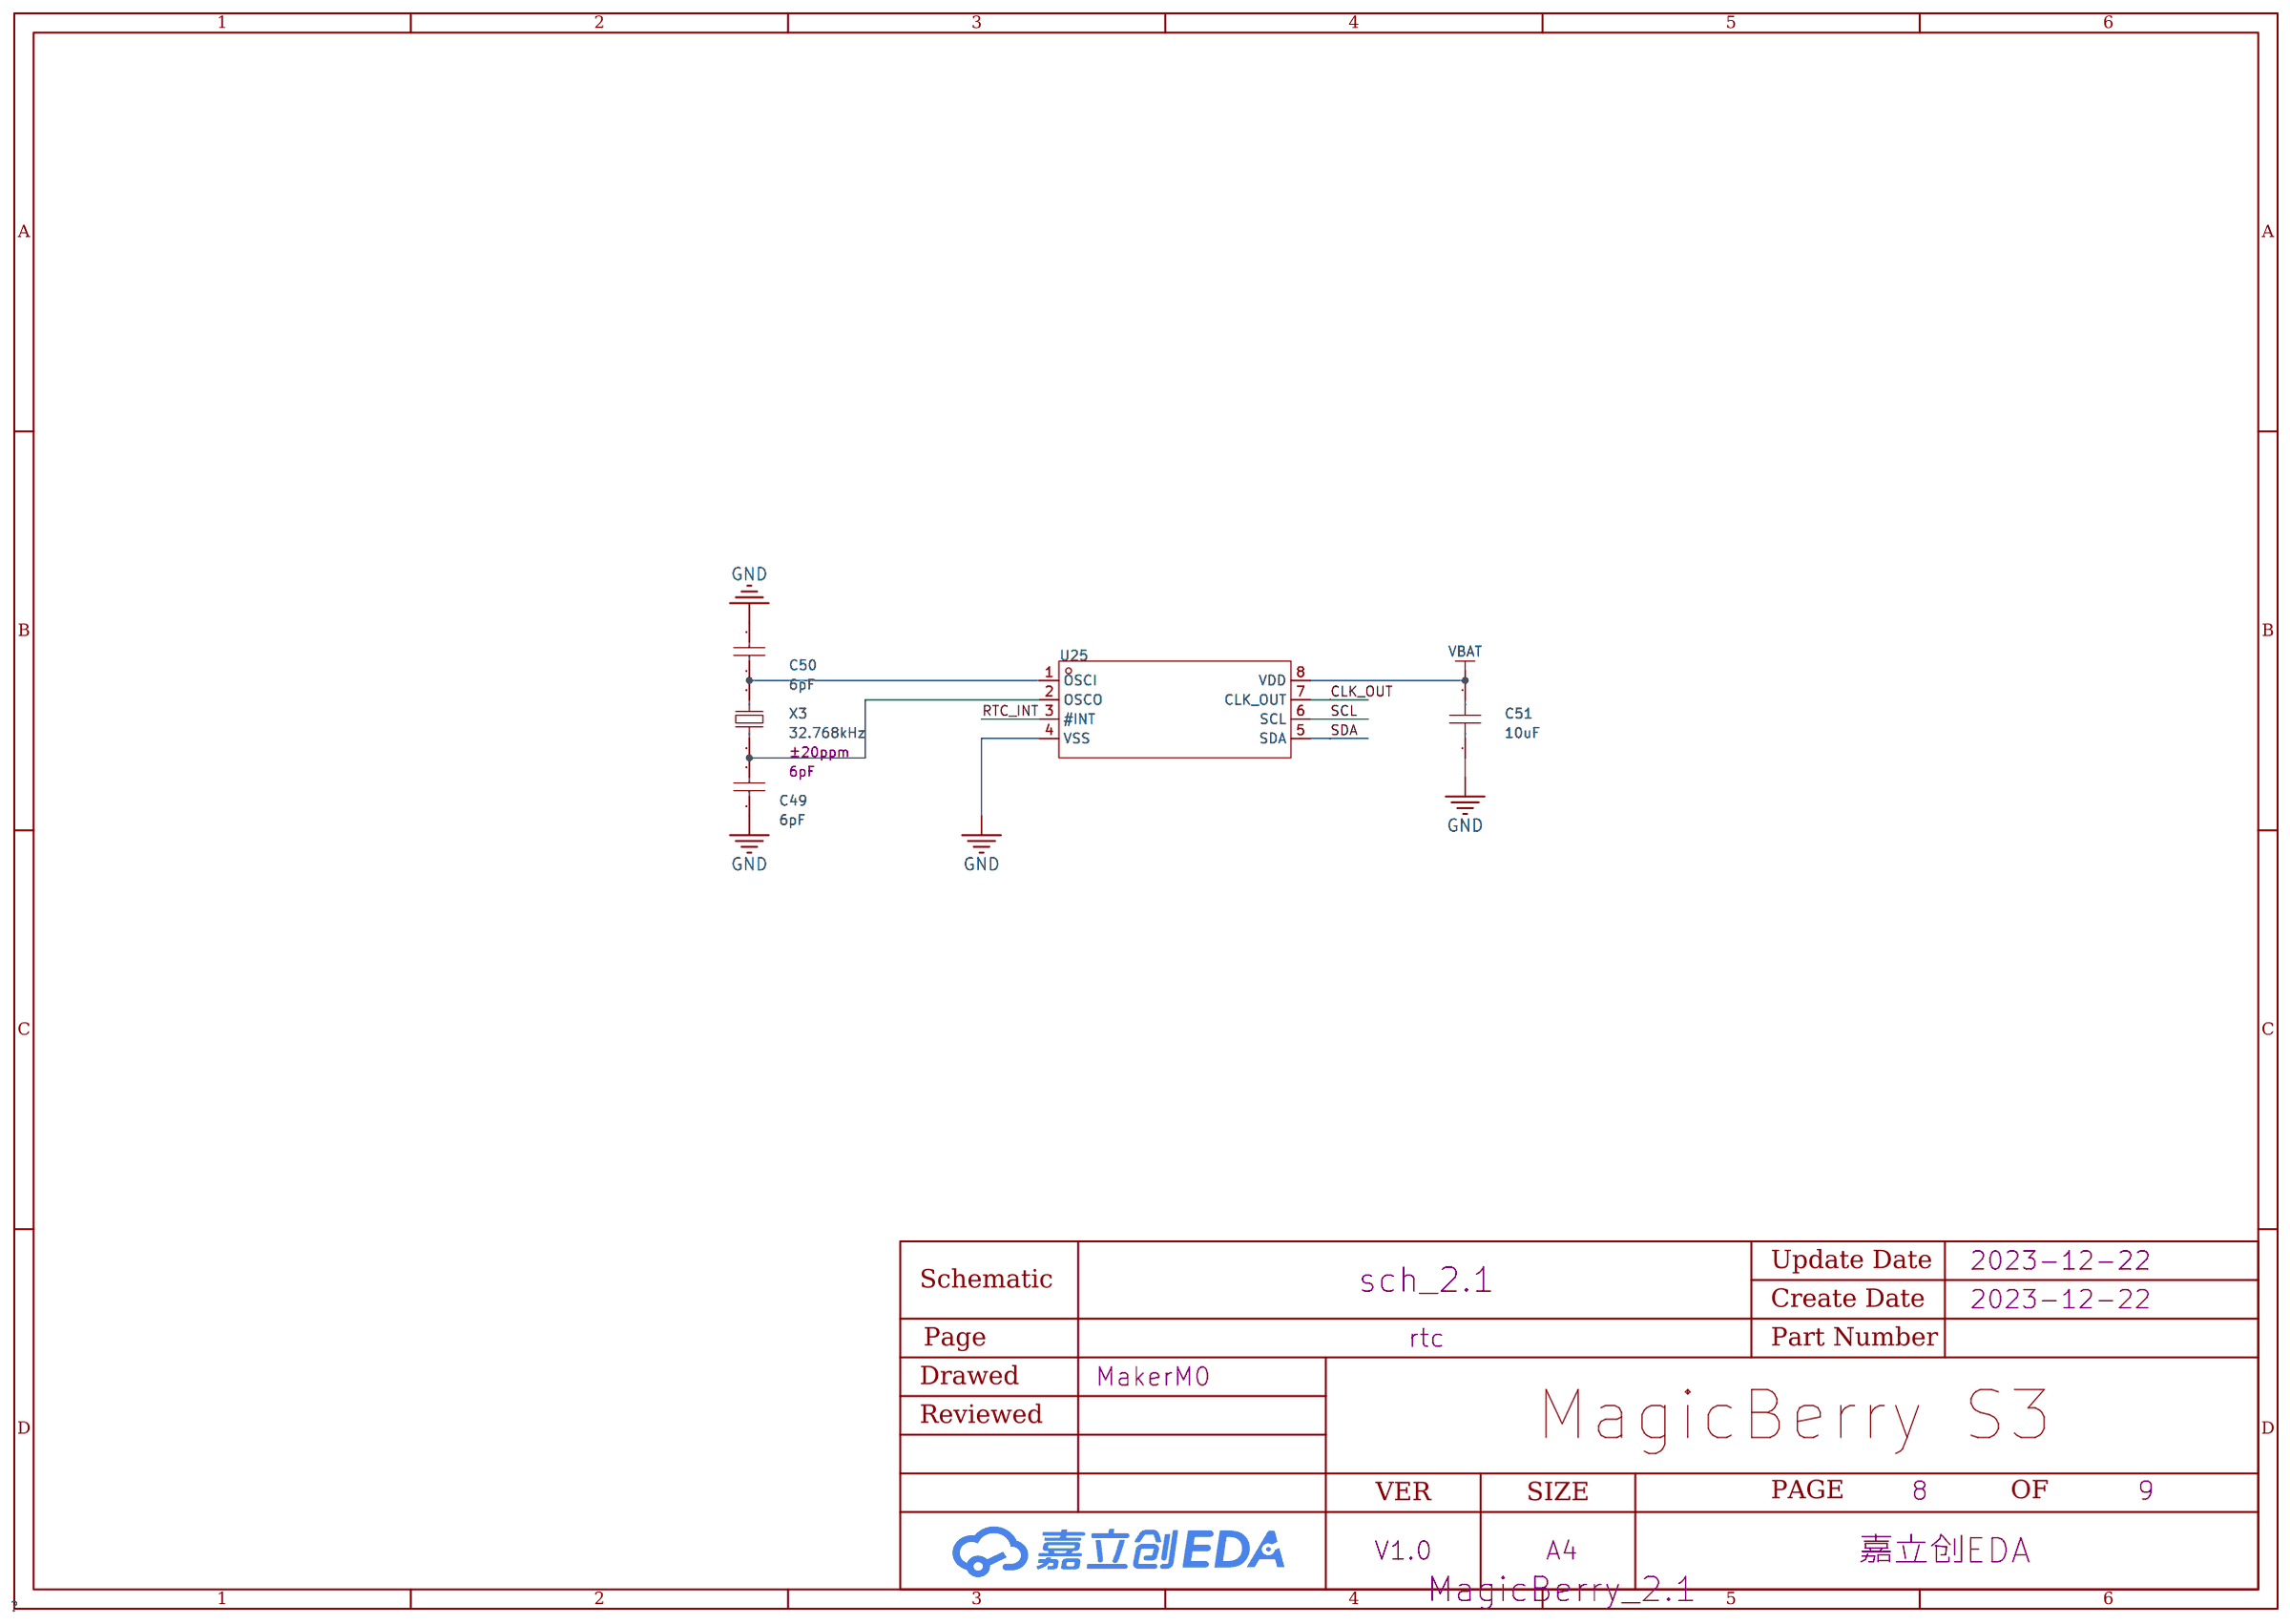
[diagram p7: rtc]
9 6DOF: Page Name: 6DOF
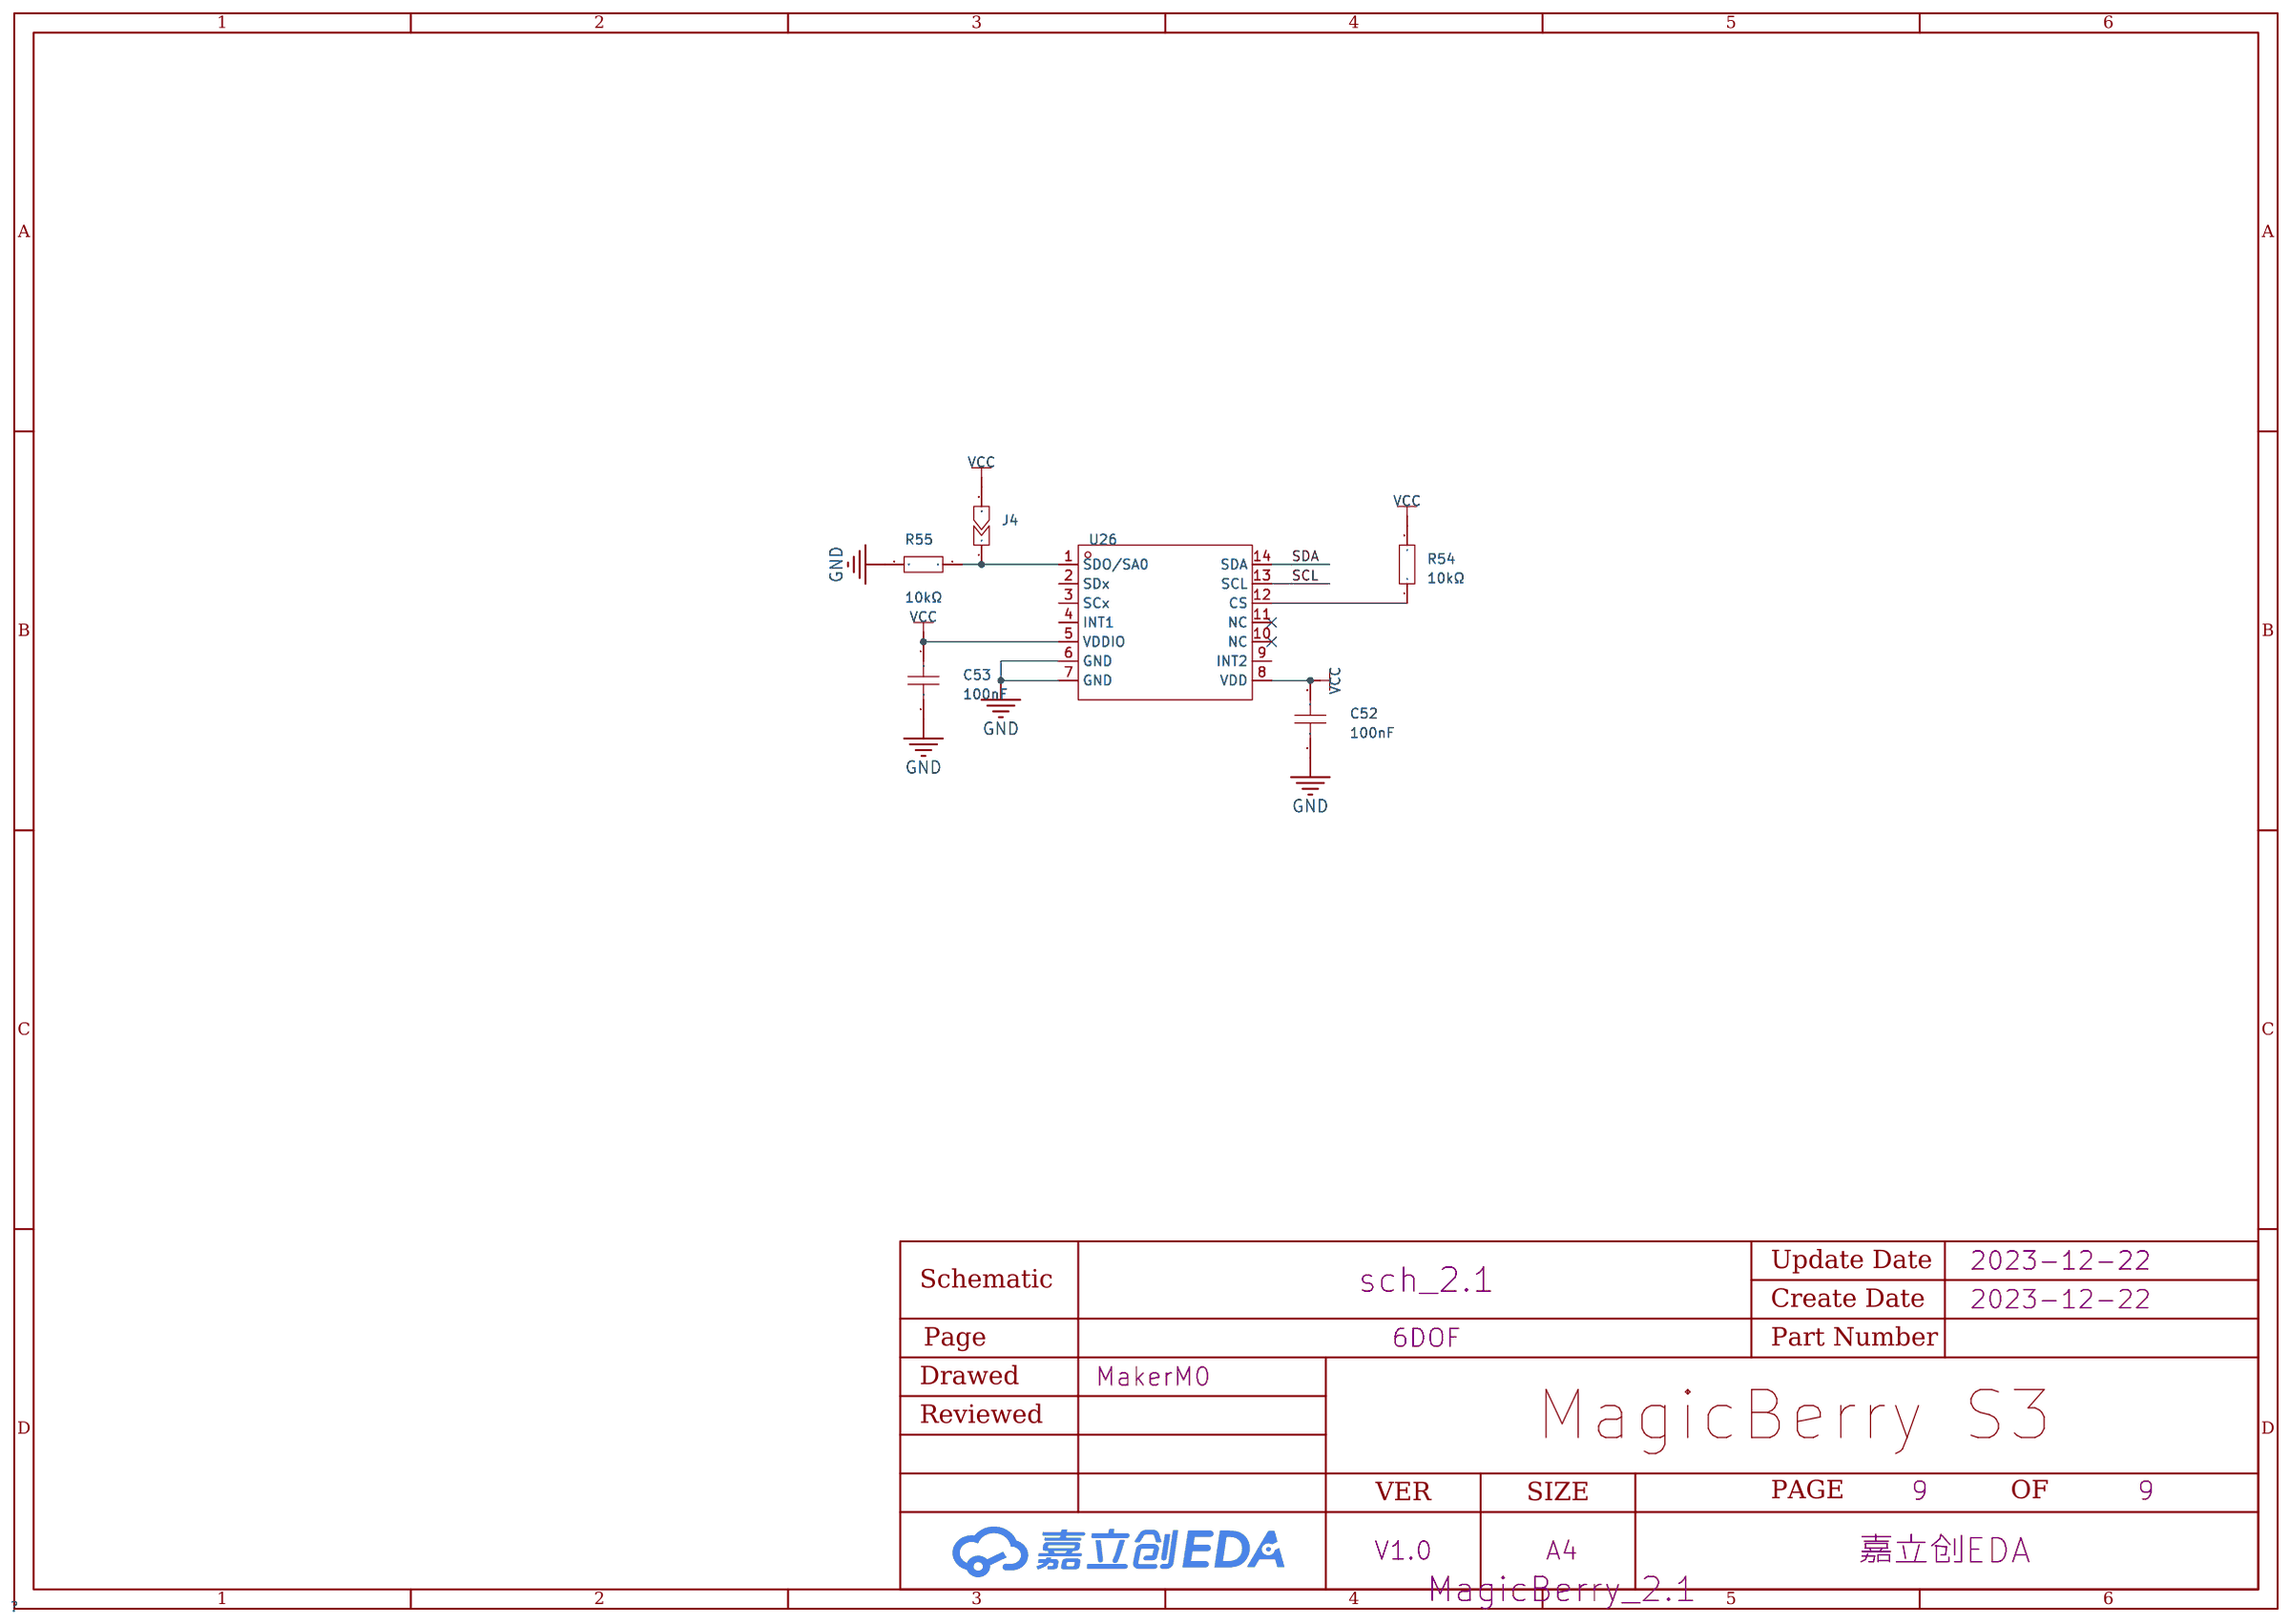
[diagram p8: 6DOF]

## Parts
sheet 6DOF
C52  100nF  [C0603]
C53  100nF  [C0603]
J4  2短路点  [短路接口]  (no BOM)
R54  10kΩ  [R0603]
R55  10kΩ  [R0603]
U26  LSM6DS3TR-C  [LGA-14_L3.0-W2.5-P0.50-TL]
sheet keyboard
C8  1uF  [C0603]
C39  1uF  [C0603]
C40  1uF  [C0603]
C41  1uF  [C0603]
CN2  BM20B(0.8)-40DS-0.4V(51)  [CONN-SMD_BM20B-0.8-40DS-0.4V-51]  (no BOM)
J1  2短路点  [短路接口]  (no BOM)
Q1  BSS138  [SOT-23-3_L2.9-W1.6-P1.90-LS2.8-BR]
Q3  BSS138  [SOT-23-3_L2.9-W1.6-P1.90-LS2.8-BR]
Q4  BSS138  [SOT-23-3_L2.9-W1.6-P1.90-LS2.8-BR]
Q5  BSS138  [SOT-23-3_L2.9-W1.6-P1.90-LS2.8-BR]
Q6  BSS138  [SOT-23-3_L2.9-W1.6-P1.90-LS2.8-BR]
R1  10kΩ  [R0603]
R10  10kΩ  [R0603]  (no BOM)
R12  10kΩ  [R0603]
R13  10kΩ  [R0603]
R14  10kΩ  [R0603]
R15  10kΩ  [R0603]
R16  10kΩ  [R0603]
R17  10kΩ  [R0603]
R18  10kΩ  [R0603]
R19  10kΩ  [R0603]
R53  10kΩ  [R0603]
U1  BBQ20KBD  [Connector_Hirose_Extra:BM20B(0.8)-40DS-0.4V]
U4  ME6212C18M5G  [SOT-23-5_L3.0-W1.7-P0.95-LS2.8-BL]
U5  ME6212C28M5G  [SOT-23-5_L3.0-W1.7-P0.95-LS2.8-BL]
sheet lcd
C16  100nF  [C0603]
C17  1uF  [C0603]
C18  100nF  [C0603]
C36  10uF  [C0603]
C37  10uF  [C0603]
C38  2.2uF  [C0603]
C43  10uF  [C0603]
FPC1  AFC01-S10FCC-00  [FPC-SMD_AFC01-S10FCC-00]
FPC2  0.5K-QX-5PWB  [FPC-SMD_5P-P0.50_HDGC_0.5K-QX-5PWB]
J2  2短路点  [短路接口]  (no BOM)
J3  2短路点  [短路接口]  (no BOM)
P1  HDR-PAD_2.54  [PAD1_SMD_1.2]
P2  HDR-PAD_2.54  [PAD1_SMD_1.2]
Q10  -  [SOT-23-3_L2.9-W1.3-P1.90-LS2.4-BR]
R44  10kΩ  [R0603]
R45  1kΩ  [R0603]
R46  20Ω  [R0603]
R47  20Ω  [R0603]
R48  20Ω  [R0603]
R49  20Ω  [R0603]
U19  ILI9341_2.4寸_SPI_18PIN  [ILI9341_2.4寸_240X320_SPI_18PIN]
U20  HX4002-MFC  [SOT-23-6_L2.9-W1.6-P0.95-LS2.8-BR]
sheet lora
C44  10uF  [C0603]
C45  100nF  [C0603]
RF1  KH-SMA-KE8-G  [CONN-SMD_KH-SMA-KE8-G]
U16  Ra-01S  [COMM-SMD_RA-01S]  (no BOM)
U22  Ra-01  [WIRELM-SMD_RA-01]
sheet mcu
C31  10uF  [C0603]
C32  100nF  [C0603]
C33  1uF  [C0603]
C42  100nF  [C0603]
R3  5.1kΩ  [R0603]
R6  5.1kΩ  [R0603]
R33  10kΩ  [R0603]
R50  100kΩ  [R0603]
R51  200kΩ  [R0603]
SW8  TD-1100SA-250  [SW-SMD_TD-1100SA-250]
SW9  TD-1100SA-250  [SW-SMD_TD-1100SA-250]
U3  X6511FRS-07-C85D30  [HDR-SMD_7P-P2.54-H-F-L11.5]
U14  ESP32-S3-WROOM-1-N8R2  [WIRELM-SMD_ESP32-S3-WROOM-1]
USBC1  TYPE-C-31-M-12  [USB-C_SMD-TYPE-C-31-M-12]
sheet power
C2  10uF  [C0603]
C5  10uF  [C0603]
C10  10uF  [C0603]
C11  10uF  [C0603]
CN1  X9821WV-02-N0SN  [CONN-TH_P1.25_X9821WV-02-NOSN]  (no BOM)
D4  1N5819WS  [SOD-323_L1.8-W1.3-LS2.5-RD]
LED5  -  [LED0603-R-RD]
Q7  AO3401A  [SOT-23_L2.9-W1.3-P1.90-LS2.4-BR]
R36  100kΩ  [R0603]
R39  1kΩ  [R0603]
R41  1.65kΩ  [R0603]
SW11  MK-12C02-G020  [SW-SMD_MK-12C02-G020]
TP3  TestPoint  [TestPoint:TestPoint_Pad_D1.0mm]  (no BOM)
TP4  TestPoint  [TestPoint:TestPoint_Pad_D1.0mm]  (no BOM)
U6  AP2112K-3.3TRG1  [SOT-25-5_L3.0-W1.8-P0.95-LS3.0-BR]
U18  -  [SOT-23-5_L3.0-W1.7-P0.95-LS2.8-BR]
sheet rtc
C49  6pF  [C0603]
C50  6pF  [C0603]
C51  10uF  [C0603]
U25  BM8563EMA  [MSOP-8_L3.0-W3.0-P0.65-LS5.0-BL]
X3  32.768kHz  [OSC-SMD_L3.2-W1.5]
sheet sd
C27  100nF  [C0603]
CARD1  TF-01A  [TF-SMD_TF-02]
R28  10kΩ  [R0603]
R29  10kΩ  [R0603]
R30  10kΩ  [R0603]
R31  10kΩ  [R0603]
R32  10kΩ  [R0603]
R34  10kΩ  [R0603]
R35  10kΩ  [R0603]
sheet speaker
C34  10uF  [C0603]
C35  100nF  [C0603]
C47  680pF  [C0603]
C48  680pF  [C0603]
L3  BLM18SG331TN1D  [L0603]
L4  BLM18SG331TN1D  [L0603]
R42  634kΩ  [R0603]
R43  100kΩ  [R0603]
U15  MAX98357AETE+T  [TQFN-16_L3.0-W3.0-P0.50-BL-EP1.5]

## Library data of the parts
C16 C18 C32 C35 C42 C45 C52 C53 = CC0603KRX7R9BB104: 容值:100nF;精度:±10%;额定电压:50V;材质(温度系数):X7R;; LCSC Part Name: 100nF ±10% 50V; Supplier Part: C14663; Manufacturer: YAGEO(国巨); Supplier Footprint: 0603; JLCPCB Part Class: Basic Part; Datasheet: https://atta.szlcsc.com/upload/public/pdf/source/20170116/1484561234239.pdf; Supplier: LCSC; Tolerance: ±10%; Voltage Rated: 50V; Temperature Coefficient: X7R
J1-J4 = 2短路点
R1 R10 R12-R19 R33 R53-R55 = 0603WAF1002T5E: 电阻类型:厚膜电阻;阻值:10kΩ;精度:±1%;功率:100mW;温度系数:±100ppm/℃;最大工作电压:75V;工作温度范围:-55℃~+155℃;; LCSC Part Name: 10kΩ ±1% 100mW; Supplier Part: C25804; Manufacturer: UNI-ROYAL(厚声); Supplier Footprint: 0603; JLCPCB Part Class: Basic Part; Datasheet: https://atta.szlcsc.com/upload/public/pdf/source/20200306/C422600_1E6D84923E4A46A82E41ADD87F860B5C.pdf; Supplier: LCSC; Type: 厚膜电阻; Tolerance: ±1%; Power(Watts): 100mW; Temperature Coefficient: ±100ppm/℃; Overload Voltage (Max): 75V; Operating Temperature Range: -55℃~+155℃
U26 = LSM6DS3TR-C: LCSC Part Name: IMU-惯性测量单元; Supplier Part: C967633; Manufacturer: ST(意法半导体); Supplier Footprint: LGA-14; JLCPCB Part Class: Extended Part; Datasheet: https://atta.szlcsc.com/upload/public/pdf/source/20210226/C967633_4D8B3A108D63359423D57B97CE5134B1.pdf; Supplier: LCSC
C8 C17 C33 C39-C41 = CL10A105KB8NNNC: 容值:1uF;精度:±10%;额定电压:50V;材质(温度系数):X5R;; LCSC Part Name: 1uF ±10% 50V; Supplier Part: C15849; Manufacturer: SAMSUNG(三星); Supplier Footprint: 0603; JLCPCB Part Class: Basic Part; Datasheet: https://atta.szlcsc.com/upload/public/pdf/source/20160103/1457707679084.pdf; Supplier: LCSC; Tolerance: ±10%; Voltage Rated: 50V; Temperature Coefficient: X5R
CN2 = BM20B(0.8)-40DS-0.4V(51): PIN总数:40;间距:0.4mm;行数:2;公母:母;安装方式:立贴;额定电流:300mA;工作温度范围:-35℃~+85℃;; LCSC Part Name: BTB板对板,BM20系列,0.4间距,40PIN母座; Supplier Part: C424543; Manufacturer: HRS(广濑); Supplier Footprint: SMD,P=0.4mm; JLCPCB Part Class: Extended Part; Datasheet: https://atta.szlcsc.com/upload/public/pdf/source/20190903/C424543_A61D720FD0DF8CC4A194B7C6C8E1C4BB.pdf; Supplier: LCSC; Number of Pins: 40; Pitch: 0.4mm; Number of Rows: 2; Gender: 母; Mounting Style: 立贴; Current Rating (Max): 300mA; Operating Temperature Range: -35℃~+85℃
Q1 Q3-Q6 = BSS138_C112239: 类型:N沟道;漏源电压(Vdss):50V;连续漏极电流(Id):220mA;功率(Pd):360mW;导通电阻(RDS(on)@Vgs,Id):3.5Ω@10V,220mA;阈值电压(Vgs(th)@Id):1.5V@1mA;; LCSC Part Name: N沟道 50V 220mA; Supplier Part: C112239; Manufacturer: SHIKUES(时科); Supplier Footprint: SOT-23-3L; JLCPCB Part Class: Extended Part; Datasheet: https://atta.szlcsc.com/upload/public/pdf/source/20170720/1500524147280.pdf; Supplier: LCSC; Type: N沟道; Drain Source Voltage (Vdss): 50V; Continuous Drain Current (Id): 220mA; Power Dissipation (Pd): 360mW; Drain Source On Resistance (RDS(on)@Vgs,Id): 3.5Ω@10V,220mA; Gate Threshold Voltage (Vgs(th)@Id): 1.5V@1mA
U1 = BM20B(0.8)-40DS-0.4V(51): PIN总数:40;间距:0.4mm;行数:2;公母:母;安装方式:立贴;额定电流:300mA;工作温度范围:-35℃~+85℃;; LCSC Part Name: BTB板对板,BM20系列,0.4间距,40PIN母座; Supplier Part: C424543; Manufacturer: HRS(广濑); Supplier Footprint: SMD,P=0.4mm; JLCPCB Part Class: Extended Part; Datasheet: https://atta.szlcsc.com/upload/public/pdf/source/20190903/C424543_A61D720FD0DF8CC4A194B7C6C8E1C4BB.pdf; Supplier: LCSC; Number of Pins: 40; Pitch: 0.4mm; Number of Rows: 2; Gender: 母; Mounting Style: 立贴; Current Rating (Max): 300mA; Operating Temperature Range: -35℃~+85℃; LCSC: C424543
U4 = ME6212C18M5G: Supplier Part: C236669; Manufacturer: MICRONE(南京微盟); Supplier Footprint: SOT-23-5; JLCPCB Part Class: Extended Part; Datasheet: https://atta.szlcsc.com/upload/public/pdf/source/20180709/C236669_29DDD08275525FA015CEDF3C5F4ADA1E.pdf; Supplier: LCSC
U5 = ME6212C28M5G: Supplier Part: C427596; Manufacturer: MICRONE(南京微盟); Supplier Footprint: SOT-23-5; JLCPCB Part Class: Extended Part; Datasheet: https://atta.szlcsc.com/upload/public/pdf/source/20190910/C427596_2C3349812C007E6093E5BA092FBDCBF3.pdf; Supplier: LCSC
C2 C5 C31 C34 C36 C37 C43 C44 C51 = CL10A106KP8NNNC: 容值:10uF;精度:±10%;额定电压:10V;材质(温度系数):X5R;; LCSC Part Name: 10uF ±10% 10V; Supplier Part: C19702; Manufacturer: SAMSUNG(三星); Supplier Footprint: 0603; JLCPCB Part Class: Basic Part; Datasheet: https://atta.szlcsc.com/upload/public/pdf/source/20160103/1457707703378.pdf; Supplier: LCSC; Tolerance: ±10%; Voltage Rated: 10V; Temperature Coefficient: X5R
C38 = CL10A225KO8NNNC: 容值:2.2uF;精度:±10%;额定电压:16V;材质(温度系数):X5R;; LCSC Part Name: 2.2uF ±10% 16V; Supplier Part: C23630; Manufacturer: SAMSUNG(三星); Supplier Footprint: 0603; JLCPCB Part Class: Basic Part; Datasheet: https://atta.szlcsc.com/upload/public/pdf/source/20160103/1457707709512.pdf; Supplier: LCSC; Tolerance: ±10%; Voltage Rated: 16V; Temperature Coefficient: X5R
FPC1 = AFC01-S10FCC-00: 间距:0.5mm;触点数量:10;锁定特性:翻盖式;安装类型:卧贴;触点类型:下接;; LCSC Part Name: 0.5mm P数:10 翻盖式 下接; Supplier Part: C262266; Manufacturer: JS(钜硕电子); Supplier Footprint: SMD,P=0.5mm; JLCPCB Part Class: Extended Part; Datasheet: https://atta.szlcsc.com/upload/public/pdf/source/20180810/C262266_E161A157AFB09C3B7930E05472619593.pdf; Supplier: LCSC; Pitch: 0.5mm; Number of Contacts: 10; Locking Feature: 翻盖式; Mounting Type: 卧贴; Contact Type: 下接; Height Above Board: 2mm; FFC, FCB Thickness: 0.3mm
FPC2 = 0.5K-QX-5PWB: 间距:0.5mm;触点数量:5;锁定特性:翻盖式;安装类型:卧贴;触点类型:下接;工作温度范围:-55℃~+85℃;; LCSC Part Name: 0.5mm P数:5 翻盖式 下接; Supplier Part: C2919476; Manufacturer: HDGC(华德共创); Supplier Footprint: SMD,P=0.5mm; JLCPCB Part Class: Extended Part; Datasheet: https://atta.szlcsc.com/upload/public/pdf/source/20211115/55A448787CA70A1AD4E6404A5BEFA17C.pdf; Supplier: LCSC; Pitch: 0.5mm; Number of Contacts: 5; Locking Feature: 翻盖式; Mounting Type: 卧贴; Contact Type: 下接; Height Above Board: 1mm; FFC, FCB Thickness: 0.3mm; Operating Temperature Range: -55℃~+85℃
P1 P2 = HDR-PAD_2.54: Pin Type: IN
Q10 = SS8050 Y1 200-350 .: 集电极电流(Ic):1.5A;功率(Pd):300mW;晶体管类型:NPN;集射极击穿电压(Vceo):25V;; Supplier Part: C2150; Manufacturer: CJ（江苏长电/长晶）; Manufacturer Part: SS8050; LCSC Stock: 138539; LCSC On Sale: 1; Supplier Footprint: SOT-23(SOT-23-3); Price: 0.126; JLCPCB Part Class: Basic Part; JLCPCB Stock: 708469; JLCPCB On Sale: 1; Datasheet: https://atta.szlcsc.com/upload/public/pdf/source/20140809/1457707209319.pdf; Supplier: LCSC; Collector Current (Ic): 1.5A; Power Dissipation (Pd): 300mW; Transistor Type: NPN; Collector-Emitter Breakdown Voltage (Vceo): 25V
R28-R32 R34 R35 R44 = 0603WAF1002T5E: 电阻类型:厚膜电阻;阻值:10kΩ;精度:±1%;功率:1/10W;温度系数:±100ppm/;最大工作电压:75V;工作温度范围:-55~+155;; LCSC Part Name: 10kΩ ±1% 1/10W; Supplier Part: C25804; Manufacturer: UNI-ROYAL(厚声); Supplier Footprint: 0603; JLCPCB Part Class: Basic Part; Datasheet: https://atta.szlcsc.com/upload/public/pdf/source/20200306/C422600_1E6D84923E4A46A82E41ADD87F860B5C.pdf; Supplier: LCSC; Type: 厚膜电阻; Tolerance: ±1%; Power(Watts): 1/10W; Temperature Coefficient: ±100ppm/; Overload Voltage (Max): 75V; Operating Temperature Range: -55~+155
R39 R45 = 0603WAF1001T5E: 电阻类型:厚膜电阻;阻值:1kΩ;精度:±1%;功率:1/10W;温度系数:±100ppm/;最大工作电压:75V;工作温度范围:-55~+155;; LCSC Part Name: 1kΩ ±1% 1/10W; Supplier Part: C21190; Manufacturer: UNI-ROYAL(厚声); Supplier Footprint: 0603; JLCPCB Part Class: Basic Part; Datasheet: https://atta.szlcsc.com/upload/public/pdf/source/20200306/C422600_1E6D84923E4A46A82E41ADD87F860B5C.pdf; Supplier: LCSC; Type: 厚膜电阻; Tolerance: ±1%; Power(Watts): 1/10W; Temperature Coefficient: ±100ppm/; Overload Voltage (Max): 75V; Operating Temperature Range: -55~+155
R46-R49 = 0603WAF200JT5E: 精度:±1%;温度系数:±100ppm/℃;阻值:20Ω;功率:1/10W;最大工作电压:75V;工作温度范围:-55℃~+155℃;; LCSC Part Name: 20Ω ±1%; Supplier Part: C22950; Manufacturer: UNI-ROYAL(厚声); Supplier Footprint: 0603; JLCPCB Part Class: Basic Part; Datasheet: https://atta.szlcsc.com/upload/public/pdf/source/20170920/C22950_1505900999591982337.pdf; Supplier: LCSC; Tolerance: ±1%; Temperature Coefficient: ±100ppm/℃; Power(Watts): 1/10W; Overload Voltage (Max): 75V; Operating Temperature Range: -55℃~+155℃
U19 = ILI9341_2.4寸_SPI_18PIN: link: https://item.taobao.com/item.htm?spm=a1z0d.6639537/tb.1997196601.4.24cd7484TibEO4amp;id=720043664330
U20 = HX4002-MFC: 功能类型:电荷泵;同步整流:否;输出通道数:1;拓扑结构:-;输入电压:2.7V~5.5V;输出电压:5V;输出电流(最大值):250mA;开关频率:1.2MHz;; LCSC Part Name: 电荷泵 Vin=2.7V~5.5V Vout=5V 250mA; Supplier Part: C172354; Manufacturer: HEXIN(禾芯微); Supplier Footprint: SOT-23-6; JLCPCB Part Class: Extended Part; Datasheet: https://atta.szlcsc.com/upload/public/pdf/source/20180202/C172354_15175649156801336361.pdf; Supplier: LCSC; Function: 电荷泵; Synchronous Rectification: 否; Number of Outputs: 1; Input Voltage: 2.7V~5.5V; Output Voltage: 5V; Output Current (Max): 250mA; Switching Frequency: 1.2MHz
RF1 = KH-SMA-KE8-G: 连接器类型:板端;射频系列:SMA;接口类型:内孔;端口数量:1;阻抗:-;频率-最大值:-;样式:偏脚;接口直径:-;接口长度/高度:8mm;工作温度范围:-;; LCSC Part Name: SMA 内孔 偏脚 镀金外螺内孔侧插半牙; Supplier Part: C530661; Manufacturer: kinghelm(金航标); Supplier Footprint: 插件; JLCPCB Part Class: Extended Part; Datasheet: https://atta.szlcsc.com/upload/public/pdf/source/20200512/C530661_F969D51668E6BC228544FB5FCDBC3D39.pdf; Supplier: LCSC; Connector Type: 板端; RF Series: SMA; Interface Type: 内孔; Number of Ports: 1; Style: 偏脚; Interface Length/Height: 8mm
U16 = Ra-01S: LCSC Part Name: LoRa 系列模块 两件套; Supplier Part: C724871; Manufacturer: Ai-Thinker(安信可); Supplier Footprint: SMD,16x17mm; JLCPCB Part Class: Extended Part; Datasheet: https://atta.szlcsc.com/upload/public/pdf/source/20200817/C724871_2AF484FC0F3C4881D6FA39AA3259953D.pdf; Supplier: LCSC
U22 = Ra-01: SX1278LoRa扩频无线模块/超远10KM/433M/安信可Ra-01; LCSC Part Name: SX1278LoRa扩频无线模块/超远10KM/433M  配天线（两件套）; Supplier Part: C90040; Manufacturer: Ai-Thinker(安信可); JLCPCB Part Class: Extended Part; Datasheet: https://atta.szlcsc.com/upload/public/pdf/source/20180719/C90040_7D0E540C57BE745D85EF9B627FE97069.pdf; Supplier: LCSC
R3 R6 = 0603WAF5101T5E: 电阻类型:厚膜电阻;阻值:5.1kΩ;精度:±1%;功率:100mW;温度系数:±100ppm/℃;最大工作电压:75V;工作温度范围:-55℃~+155℃;; LCSC Part Name: 5.1kΩ ±1% 100mW; Supplier Part: C23186; Manufacturer: UNI-ROYAL(厚声); Supplier Footprint: 0603; JLCPCB Part Class: Basic Part; Datasheet: https://atta.szlcsc.com/upload/public/pdf/source/20200306/C422600_1E6D84923E4A46A82E41ADD87F860B5C.pdf; Supplier: LCSC; Type: 厚膜电阻; Tolerance: ±1%; Power(Watts): 100mW; Temperature Coefficient: ±100ppm/℃; Overload Voltage (Max): 75V; Operating Temperature Range: -55℃~+155℃
R50 = 0603WAF1003T5E: 电阻类型:厚膜电阻;阻值:100kΩ;精度:±1%;功率:100mW;; LCSC Part Name: 100kΩ ±1% 100mW; Supplier Part: C25803; Manufacturer: UNI-ROYAL(厚声); Supplier Footprint: 0603; JLCPCB Part Class: Basic Part; Datasheet: https://atta.szlcsc.com/upload/public/pdf/source/20200306/C422600_1E6D84923E4A46A82E41ADD87F860B5C.pdf; Supplier: LCSC; Type: 厚膜电阻; Tolerance: ±1%; Power(Watts): 100mW; Temperature Coefficient: ±100ppm/℃; Overload Voltage (Max): 75V; Operating Temperature Range: -55℃~+155℃
R51 = 0603WAF2003T5E: 电阻类型:厚膜电阻;阻值:200kΩ;精度:±1%;功率:100mW;; LCSC Part Name: 200kΩ ±1% 100mW; Supplier Part: C25811; Manufacturer: UNI-ROYAL(厚声); Supplier Footprint: 0603; JLCPCB Part Class: Basic Part; Datasheet: https://atta.szlcsc.com/upload/public/pdf/source/20200306/C422600_1E6D84923E4A46A82E41ADD87F860B5C.pdf; Supplier: LCSC; Type: 厚膜电阻; Tolerance: ±1%; Power(Watts): 100mW; Temperature Coefficient: ±100ppm/℃; Overload Voltage (Max): 75V; Operating Temperature Range: -55℃~+155℃
SW8 SW9 = TD-1100SA-250: LCSC Part Name: TD-1100SA-250 侧按; Supplier Part: C2905201; Manufacturer: DEALON(德艺隆); Supplier Footprint: SMD; JLCPCB Part Class: Extended Part; Datasheet: https://atta.szlcsc.com/upload/public/pdf/source/20211209/3FE33918AAAC3B027476F5D861A76BF1.pdf; Supplier: LCSC
U3 = X6511FRS-07-C85D30: 排数:单排;总孔位数:7;间距:2.54mm;插孔结构:1x7P;安装类型:卧贴;塑高:8.5mm;; LCSC Part Name: 2.54mm 1x7P; Supplier Part: C5142240; Manufacturer: XKB Connectivity(中国星坤); Supplier Footprint: SMD,P=2.54mm; Datasheet: https://atta.szlcsc.com/upload/public/pdf/source/20220822/AB9A82E80C220285963E5EFA3BFD32FF.pdf; Supplier: LCSC; Number of Rows: 单排; Number of Holes: 7; Pitch: 2.54mm; Holes Structure: 1x7P; Mounting Type: 卧贴; Insulation Height: 8.5mm
U14 = ESP32-S3-WROOM-1-N8R2: Supplier Part: C2913204; Manufacturer: ESPRESSIF(乐鑫); Supplier Footprint: SMD,18x25.5mm; JLCPCB Part Class: Extended Part; Datasheet: https://atta.szlcsc.com/upload/public/pdf/source/20220628/A2AC12B3C87735CAEB7EBE2DBE80936C.pdf; Supplier: LCSC
USBC1 = TYPE-C-31-M-12: 连接器类型:Type-C;标准:-;公母:母座;触点数量:16;端口数量:1;额定电流 - 电源:250mA;; Supplier Part: C165948; Manufacturer: 韩国韩荣; JLCPCB Part Class: Extended Part; Datasheet: https://atta.szlcsc.com/upload/public/pdf/source/20210111/C2682493_D8CCFED08835E878D16ACCF4460E43B8.pdf; Supplier: LCSC; Connector Type: Type-C; Gender: 母座; Number of Contacts: 16; Number of Ports: 1; Current Rating - Power (Max): 250mA
C10 C11 = CL10A106KP8NNNC: 容值:10uF;精度:±10%;额定电压:10V;温度系数:X5R;; LCSC Part Name: 10uF ±10% 10V; Supplier Part: C19702; Manufacturer: SAMSUNG(三星); Supplier Footprint: 0603; JLCPCB Part Class: Basic Part; Datasheet: https://atta.szlcsc.com/upload/public/pdf/source/20160103/1457707703378.pdf; Supplier: LCSC; Tolerance: ±10%; Voltage Rated: 10V; Temperature Coefficient: X5R
CN1 = X9821WV-02-N0SN: 参考系列:-;间距:1.25mm;插针结构:1x2P;排数:1;每排PIN数:2;行距:-;公母:母型插口;安装方式:-;触头材质:磷青铜;触头镀层:锡;工作温度范围:-25~+85;焊接温度(最大值):260;; LCSC Part Name: 1.25mm 1x2P; Supplier Part: C518987; Manufacturer: XKB Connectivity(中国星坤); Supplier Footprint: 插件,P=1.25mm; JLCPCB Part Class: Extended Part; Datasheet: https://atta.szlcsc.com/upload/public/pdf/source/20211009/4A1C5BBDED0B2F1F6DD5A1E68F7C8015.pdf; Supplier: LCSC; Pitch: 1.25mm; Pins Structure: 1x2P; Number of Rows: 1; Number of PINs Per Row: 2; Gender: 母型插口; Contact Material: 磷青铜; Contact Plating: 锡; Operating Temperature Range: -25~+85; Welding Temperature (Max): 260
D4 = 1N5819WS_C191023: 直流反向耐压(Vr):40V;平均整流电流(Io):1A;正向压降(Vf):600mV@1A;; LCSC Part Name: 40V 1A 600mV@1A; Supplier Part: C191023; Manufacturer: Hottech(合科泰); Supplier Footprint: SOD-323; JLCPCB Part Class: Basic Part; Datasheet: https://atta.szlcsc.com/upload/public/pdf/source/20180614/C191023_3C6A6398B911F3A4C23E7538EE054643.pdf; Supplier: LCSC; Reverse Voltage (Vr): 40V; Average Rectified Current (Io): 1A; Forward Voltage (Vf@If): 600mV@1A
LED5 = 19-217/R6C-AL1M2VY/3T: 发光颜色:红灯;二极管配置:-;透镜颜色:无色透明;主波长:617.5nm;峰值波长:632nm;色温:-;光通量(25时):-;测试电流:5mA;正向电压(VF):2.2V;发光强度:28.5mcd;功率:60mW;发光角度:120°;安装方式:-;工作温度:-40~+85;; LCSC Part Name: 红灯; Supplier Part: C72044; Manufacturer: EVERLIGHT(台湾亿光); Supplier Footprint: 0603; JLCPCB Part Class: Extended Part; Datasheet: https://atta.szlcsc.com/upload/public/pdf/source/20160507/1462613613821.pdf; Supplier: LCSC; Emitted Color: 红灯; Lens Color: 无色透明; Dominant Wavelength: 617.5nm; Peak Wavelength: 632nm; Forward Current: 5mA; Forward Voltage (VF): 2.2V; Luminous Intensity: 28.5mcd; Power Dissipation: 60mW; Viewing Angle: 120°; Operating Temperature: -40~+85
Q7 = AO3401A_C15127: 类型:P沟道;漏源电压(Vdss):30V;连续漏极电流(Id):4A;功率(Pd):1.4W;导通电阻(RDS(on)@Vgs,Id):44mΩ@10V,4.3A;阈值电压(Vgs(th)@Id):1.3V@250A;; LCSC Part Name: P沟道 30V 4A; Supplier Part: C15127; Manufacturer: AOS; Supplier Footprint: SOT-23-3L; JLCPCB Part Class: Basic Part; Datasheet: https://atta.szlcsc.com/upload/public/pdf/source/20160507/1462613609053.pdf; Supplier: LCSC; Type: P沟道; Drain Source Voltage (Vdss): 30V; Continuous Drain Current (Id): 4A; Power Dissipation (Pd): 1.4W; Drain Source On Resistance (RDS(on)@Vgs,Id): 44mΩ@10V,4.3A; Gate Threshold Voltage (Vgs(th)@Id): 1.3V@250A
R36 R43 = 0603WAF1003T5E: 精度:±1%;阻值:100kΩ;温度系数:±100ppm/;功率:1/10W;最大工作电压:75V;工作温度范围:-55~+155;; LCSC Part Name: 100KΩ ±1%; Supplier Part: C25803; Manufacturer: UNI-ROYAL(厚声); Supplier Footprint: 0603; JLCPCB Part Class: Basic Part; Datasheet: https://atta.szlcsc.com/upload/public/pdf/source/20170920/C25803_1505901551039983376.pdf; Supplier: LCSC; Tolerance: ±1%; Temperature Coefficient: ±100ppm/; Power(Watts): 1/10W; Overload Voltage (Max): 75V; Operating Temperature Range: -55~+155
R41 = FRC0603F1651TS: 电阻类型:厚膜电阻;阻值:1.65kΩ;精度:±1%;功率:100mW;; LCSC Part Name: 1.65kΩ ±1% 100mW; Supplier Part: C2930051; Manufacturer: FOJAN(富捷); Supplier Footprint: 0603; JLCPCB Part Class: Extended Part; Datasheet: https://atta.szlcsc.com/upload/public/pdf/source/20211221/9022FBEBBD509006A57EBC43C1F2F40C.pdf; Supplier: LCSC; Type: 厚膜电阻; Tolerance: ±1%; Power(Watts): 100mW; Overload Voltage (Max): 75V; Operating Temperature Range: -55℃~+155℃
SW11 = MK-12C02-G020: 七脚小拨动开关G2.0; LCSC Part Name: 微型拨动开关; Supplier Part: C963206; Manufacturer: G-Switch(品赞); Supplier Footprint: SMD,6.7x2.3x1.4mm; JLCPCB Part Class: Extended Part; Datasheet: https://atta.szlcsc.com/upload/public/pdf/source/20200902/C778186_2AF08473ED98414D93A175E8814EEFA6.pdf; Supplier: LCSC
TP3 TP4 = connector_testpoint: Pin Type: IN
U6 = AP2112K-3.3TRG1: 输出类型:固定;输出极性:正;输出通道数:1;最大输入电压:6V;输出电压:3.3V;压差:400mV@(600mA);输出电流:600mA;电源纹波抑制比(PSRR):65dB@(100Hz,1kHz);; LCSC Part Name: 正 Vin=6V Vout=3.3V 600mA 65dB@(100Hz,1kHz); Supplier Part: C51118; Manufacturer: DIODES(美台); Supplier Footprint: SOT-25-5; JLCPCB Part Class: Extended Part; Datasheet: https://atta.szlcsc.com/upload/public/pdf/source/20171221/C51118_15138312998391195590.pdf; Supplier: LCSC; Output Type: 固定; Output Polarity: 正; Number of Outputs: 1; Maximum Input Voltage: 6V; Output Voltage: 3.3V; Dropout Voltage: 400mV@(600mA); Output Current: 600mA; Power Supply Rejection Ratio (PSRR): 65dB@(100Hz,1kHz)
U18 = TP4054-42-SOT25R: 充电电池的类型:-;电池单元组数:-;最大充电电流:-;充满的电池组电压:-;最大供应电压:-;; Supplier Part: C32574; Manufacturer: TOPPOWER(南京拓微); Supplier Footprint: SOT-23-5; JLCPCB Part Class: Basic Part; Datasheet: https://atta.szlcsc.com/upload/public/pdf/source/20140621/1457707095588.pdf; Supplier: LCSC
C49 C50 = 0603CG6R0C500NT: 容值:6pF;额定电压:50V;材质(温度系数):C0G;; LCSC Part Name: 6pF 50V ±0.25pF; Supplier Part: C37474; Manufacturer: FH(风华); Supplier Footprint: 0603; JLCPCB Part Class: Basic Part; Datasheet: https://atta.szlcsc.com/upload/public/pdf/source/20170923/C37474_1506149444969988742.pdf; Supplier: LCSC; Voltage Rated: 50V; Temperature Coefficient: C0G
U25 = BM8563EMA: 低功耗CMOS实时时钟/日历芯片; Supplier Part: C269878; Manufacturer: GATEMODE(捷茂微); Supplier Footprint: MSOP-8; JLCPCB Part Class: Extended Part; Datasheet: https://atta.szlcsc.com/upload/public/pdf/source/20180912/C269878_63AF37B959074677F199CFDDF2EA709F.pdf; Supplier: LCSC
X3 = X1A000141000600: 频率:32.768kHz;频率公差:±20ppm;负载电容:6pF;; LCSC Part Name: 32.768kHz ±20ppm 6pF; Supplier Part: C94673; Manufacturer: EPSON(爱普生); Supplier Footprint: SMD3215-2P; JLCPCB Part Class: Extended Part; Datasheet: https://atta.szlcsc.com/upload/public/pdf/source/20190514/C94673_CD9A832326E72C6A13C3517DC646443E.pdf; Supplier: LCSC; Crystal Type: 贴片无源晶振; Frequency Tolerance: ±20ppm; Load Capacitance: 6pF; Operating Temperature: -40℃~+85℃
C27 = CL10B104KB8NNNC: 容值:100nF;精度:±10%;额定电压:50V;温度系数:X7R;; LCSC Part Name: 100nF ±10% 50V; Supplier Part: C1591; Manufacturer: SAMSUNG(三星); Supplier Footprint: 0603; JLCPCB Part Class: Extended Part; Datasheet: https://atta.szlcsc.com/upload/public/pdf/source/20160103/1457707680512.pdf; Supplier: LCSC; Tolerance: ±10%; Voltage Rated: 50V; Temperature Coefficient: X7R
CARD1 = TF-01A_C2889258: 卡类型:MicroSD卡(TF卡);连接器类型:卡座;卡连接方式:自弹式;本体最大高度:2mm;工作温度范围:-;; LCSC Part Name: TF卡座自弹式9P外焊卡座; Supplier Part: C2889258; Manufacturer: Yuandi(元迪); Supplier Footprint: SMD; JLCPCB Part Class: Extended Part; Datasheet: https://atta.szlcsc.com/upload/public/pdf/source/20210830/44259D2B93BF4B637A446EF1520C4989.pdf; Supplier: LCSC; Card Type: MicroSD卡(TF卡); Connector Type: 卡座; Card Connection Mode: 自弹式; Maximum Body Height: 2mm
C47 C48 = 0603B681K500NT: 容值:680pF;精度:±10%;额定电压:50V;材质(温度系数):X7R;; LCSC Part Name: 680pF ±10% 50V; Supplier Part: C1630; Manufacturer: FH(风华); Supplier Footprint: 0603; JLCPCB Part Class: Basic Part; Datasheet: https://atta.szlcsc.com/upload/public/pdf/source/20170923/C1630_1506149298238988425.pdf; Supplier: LCSC; Tolerance: ±10%; Voltage Rated: 50V; Temperature Coefficient: X7R
L3 L4 = BLM18SG331TN1D: 标称阻抗@测试频率:330Ω@100MHz;误差:±25%;直流电阻(RDC):70mΩ;; LCSC Part Name: 单路 0603磁珠 阻抗330Ω@100MHz; Supplier Part: C88989; Manufacturer: muRata(村田); Supplier Footprint: 0603; JLCPCB Part Class: Extended Part; Datasheet: https://atta.szlcsc.com/upload/public/pdf/source/20180326/C88989_E77110ECB70599E5C39DB4FE82EA7FD9.pdf; Supplier: LCSC; Impedance @ Frequency: 330Ω@100MHz; Tolerance: ±25%; DC Resistance: 70mΩ; Current Rating: 1.5A; Circuits: 1
R42 = RC0603FR-07634KL: 电阻类型:厚膜电阻;阻值:634kΩ;精度:±1%;功率:100mW;; LCSC Part Name: 634kΩ ±1% 100mW; Supplier Part: C273753; Manufacturer: YAGEO(国巨); Supplier Footprint: 0603; JLCPCB Part Class: Extended Part; Datasheet: https://atta.szlcsc.com/upload/public/pdf/source/20191125/C273753_901BC2F8FEE117E6429E5D997CD78CF2.pdf; Supplier: LCSC; Type: 厚膜电阻; Tolerance: ±1%; Power(Watts): 100mW; Temperature Coefficient: ±100ppm/℃; Overload Voltage (Max): 75V; Operating Temperature Range: -55℃~+155℃
U15 = MAX98357AETE+T: 功放类型:-;输出功率:-;; Supplier Part: C910544; Manufacturer: ADI(亚德诺)/MAXIM(美信); Supplier Footprint: TQFN-16-EP(3x3); JLCPCB Part Class: Extended Part; Datasheet: https://atta.szlcsc.com/upload/public/pdf/source/20210106/C910544_CB6DE4B2CEE254A72E6BDB40E718D281.pdf; Supplier: LCSC

## Nets
1.8V: C40.1 Q3.1(G) Q4.1(G) Q5.1(G) Q6.1(G) R10.2 R12.2 R14.2 R16.2 R18.2 U1.10(1V8) U4.5(VOUT)
2.8V: C39.1 U1.8(2V8) U5.5(VOUT)
3.3V: C5.2 C8.1 C27.2 C31.2 C32.1 C34.2 C35.1 C36.2 C41.1 C43.2 C44.2 C45.1 C52.1 C53.1 CARD1.4(VDD) FPC2.5 J1.2 J3.1 J4.2 P1.1 R13.2 R15.2 R17.2 R19.2 R28.2 R29.2 R30.2 R31.2 R32.2 R33.2 R34.2 R35.2 R42.2 R43.2 R54.2 U1.34(LEDA) U1.36(LEDA) U3.3 U4.1(VIN) U4.3(CE) U5.1(VIN) U5.3(CE) U6.5(VOUT) U14.2(3V3) U15.7(VDD) U15.8(VDD) U16.3(3.3V) U19.9(VCC) U19.10(LEDA) U20.3(EN) U20.5(VIN) U22.3(3.3V) U26.5(VDDIO) U26.8(VDD)
+5V: C11.2 D4.2(A) LED5.1(A) Q7.1(G) R36.2 U18.4(VCC) USBC1.A4(VBUS) USBC1.A9(VBUS) USBC1.B4(VBUS) USBC1.B9(VBUS)
GND: C2.2 C5.1 C8.2 C10.1 C11.1 C16.2 C17.2 C18.2 C27.1 C31.1 C32.2 C33.2 C34.1 C35.2 C36.1 C37.1 C39.2 C40.2 C41.2 C42.2 C43.1 C44.1 C45.2 C47.1 C48.2 C49.1 C50.2 C51.1 C52.2 C53.2 CARD1.6(VSS) CARD1.10(GND) CARD1.11(GND) CARD1.12(GND) CARD1.13(GND) CN1.2 FPC1.8 FPC1.9 FPC1.10 FPC1.11 FPC1.12 FPC2.6 FPC2.7 Q1.2(S) Q10.2(E) R1.1 R3.2 R6.2 R36.1 R41.1 R44.1 R50.1 R53.1 R55.2 RF1.1 RF1.2 RF1.3 RF1.4 SW8.1 SW9.1 TP4.1 U1.1(GND) U1.7(GND) U1.9(GND) U1.11(GND) U1.19(GND) U1.20(GND) U1.21(GND) U1.22(AGND) U1.25(GND) U1.40(GND) U3.4 U4.2(VSS) U5.2(VSS) U6.2(GND) U14.1(GND) U14.40(GND) U14.41(GND) U15.3(GND) U15.11(GND) U15.15(GND) U15.17(EP) U16.2(GND) U16.9(GND) U16.16(GND) U18.2(GND) U19.1(GND) U19.8(GND) U20.2(GND) U22.2(GND) U22.9(GND) U22.16(GND) U25.4(VSS) U26.6(GND) U26.7(GND) USBC1.0(SH) USBC1.1(SH) USBC1.2(SH) USBC1.3(SH) USBC1.A1(GND) USBC1.A12(GND) USBC1.B1(GND) USBC1.B12(GND)
VBAT: C10.2 C51.2 CN1.1 SW11.2 TP3.1 U18.3(BAT) U25.8(VDD)
VBAT_OUT: Q7.3(D) SW11.1
AUDIO_SD: R42.1 U14.39(IO1) U15.4(SD_MODE#)
BACKLIGHT: Q1.1(G) R1.2 U14.32(IO39)
BAT_ADC: C42.1 R50.2 R51.1 U14.17(IO9)
CLK_OUT: U25.7(CLK_OUT)
COL1: U1.12(COL1) U14.24(IO47)
COL2: U1.13(COL2) U14.23(IO21)
COL3: U1.14(COL3) U14.22(IO14)
COL4: U1.15(COL4) U14.21(IO13)
COL5: U1.16(COL5) U14.18(IO10)
COL6: U1.17(COL6) U14.19(IO11)
COL7: U1.18(COL7) U14.20(IO12)
EN: C33.1 Q6.3(D) R19.1 R33.1 SW9.2 U3.7 U14.3(EN) U16.4(RESET) U19.2(RST) U22.4(RESET)
I2S_BCK: U14.37(TXD0) U15.16(BCLK)
I2S_DATA: U14.12(IO8) U15.1(DIN)
I2S_WS: U14.36(RXD0) U15.14(LRCLK)
IO0: SW8.2 U1.28(ROW5) U14.27(IO0)
IO2: Q3.3(D) R13.1 U3.1 U14.38(IO2) U25.6(SCL) U26.13(SCL)
IO3: FPC1.3 U14.15(IO3) U19.5(CS)
IO4: R45.1 U14.4(IO4)
IO5: U14.5(IO5) U16.15(NSS) U22.15(NSS)
IO6: U3.6 U14.6(IO6)
IO7: U14.7(IO7) U16.5(TXEN) U22.5(DIO0)
IO15: CARD1.7(DAT0) R31.1 U14.8(IO15) U16.13(MISO) U19.7(SDO) U22.13(MISO)
IO16: CARD1.2(CD/DAT3) R28.1 U14.9(IO16)
IO17: CARD1.5(CLK) FPC1.1 R30.1 U14.10(IO17) U16.12(SCK) U19.3(SCL) U22.12(SCK)
IO18: CARD1.3(CMD) FPC1.2 R29.1 U14.11(IO18) U16.14(MOSI) U19.6(SDA) U22.14(MOSI)
IO19: U14.13(IO19) USBC1.A7(DN1) USBC1.B7(DN2)
IO20: U14.14(IO20) USBC1.A6(DP1) USBC1.B6(DP2)
IO35: U1.29(ROW4) U14.28(IO35)
IO36: U1.30(ROW3) U14.29(IO36)
IO37: U1.31(ROW2) U14.30(IO37)
IO38: U1.32(ROW1) U14.31(IO38)
IO40: U3.5 U14.33(IO40)
IO41: Q4.3(D) R15.1 U3.2 U14.34(IO41) U25.5(SDA) U26.14(SDA)
IO42: Q5.3(D) R17.1 U14.35(IO42)
IO45: U1.27(ROW6) U14.26(IO45)
IO46: C16.1 FPC1.5 U14.16(IO46) U19.4(D/C)
IO48: U1.26(ROW7) U14.25(IO48)
LCD_+5V: C37.2 J2.1 U20.1(VOUT)
LCD_EXTCOMIN: FPC1.4
LCD_VDD: C17.1 C18.1 FPC1.6 FPC1.7 J2.2 J3.2
LEDK1: FPC2.1 FPC2.2 FPC2.3 FPC2.4 P2.1 R46.2 U19.11(LEDK1)
LEDK2: R47.2 U19.12(LEDK2)
LEDK3: R48.2 U19.13(LEDK3)
LEDK4: R49.2 U19.14(LEDK4)
LORA_ANT: RF1.5 U16.1(ANT) U22.1(ANT)
MIC: U1.23(MIC)
RTC_INT: U25.3(#INT)
SD_DETECT: CARD1.9(CD) R32.1
STATE_CHARGE: R39.1 U18.1(CHRG)
TP_MOTION_1V8: Q5.2(S) R16.1 U1.4(TP_MOTION)
TP_RESET_1V8: Q6.2(S) R18.1 U1.6(TP_RESET)
TP_SCL_1V8: Q3.2(S) R12.1 U1.3(TP_SCL)
TP_SDA_1V8: Q4.2(S) R14.1 U1.5(TP_SDA)
TP_SHUTDOWN_1V8: R10.1 R53.2 U1.2(TP_SHUTDOWN)
VON: C48.1 L3.2
VOP: C47.2 L4.2
VSYS: C2.1 D4.1(C) Q7.2(S) R51.2 U6.1(VIN) U6.3(EN)
$1N3932: R6.1 USBC1.B5(CC2)
$1N3938: R3.1 USBC1.A5(CC1)
$2N4033: Q10.1(B) R44.2 R45.2
$2N4464: Q10.3(C) R46.1 R47.1 R48.1 R49.1
$2N4931: C38.1 U20.4(C-)
$2N4934: C38.2 U20.6(C+)
$3N1671: CARD1.8(DAT1) R35.1
$3N1675: CARD1.1(DAT2) R34.1
$4N13436: R41.2 U18.5(PROG)
$4N13446: LED5.2(C) R39.2
$5N525: R43.1 U15.2(GAIN_SLOT)
$5N2893: L3.1 U15.10(OUTN)
$5N2899: L4.1 U15.9(OUTP)
$8N1366: J1.1 U1.24(MIC_VDD)
$8N1374: Q1.3(D) U1.33(LEDK) U1.35(LEDK) U1.37(LEDK)
$11N541: C50.1 U25.1(OSCI) X3.2
$11N548: C49.2 U25.2(OSCO) X3.1
$12N227: R54.1 U26.12(CS)
$12N283: J4.1 R55.1 U26.1(SDO/SA0)

Not connected (* = marked no-connect by the designer): CN2 1 2 3 4 5 6 7 8 9 10 11 12 13 14 15 16 17 18 19 20 21 22 23 24 25 26 27 28 29 30 31 32 33 34 35 36 37 38 39 40 41 42; SW8 3 4; SW9 3 4; SW11 3 4 5 6 7; U1 38(NC) 39(NC); U4 4(NC)*; U5 4(NC)*; U6 4(NC)*; U15 5(N.C.)* 6(N.C.)* 12(N.C.)* 13(N.C.)*; U16 6(DIO1) 7(DIO2) 8(DIO3) 10(BUSY) 11(RXEN); U19 15(XL) 16(YU) 17(YR) 18(YD); U22 6(DIO1) 7(DIO2) 8(DIO3) 10(DIO4) 11(DIO5); U26 2(SDx) 3(SCx) 4(INT1) 9(INT2) 10(NC)* 11(NC)*; USBC1 A8(SBU1)* B8(SBU2)*

## Notes on the sheets
sheet 2
- extmode:0
- LS027B7DH01:  5V
- LPM027M128B:  3.3V
- 对于中景园购买的彩屏，R47、R48、R49不要焊接
- 二选一，屏幕2.7MLCD和2.4寸IPS TFT
sheet 4
- 404050电池
  C426305
- 0.4A充电
- 2022/10/30：增加电源管理电路
sheet 5
- Shutdown and Channel Select. Pull SD_MODE low to place the device in shutdown
sheet 7
- Q20   from https://github.com/solderparty/bbq20kbd_hw
